# EAGLE design LedTile200mm (EAGLE 7.4.0)
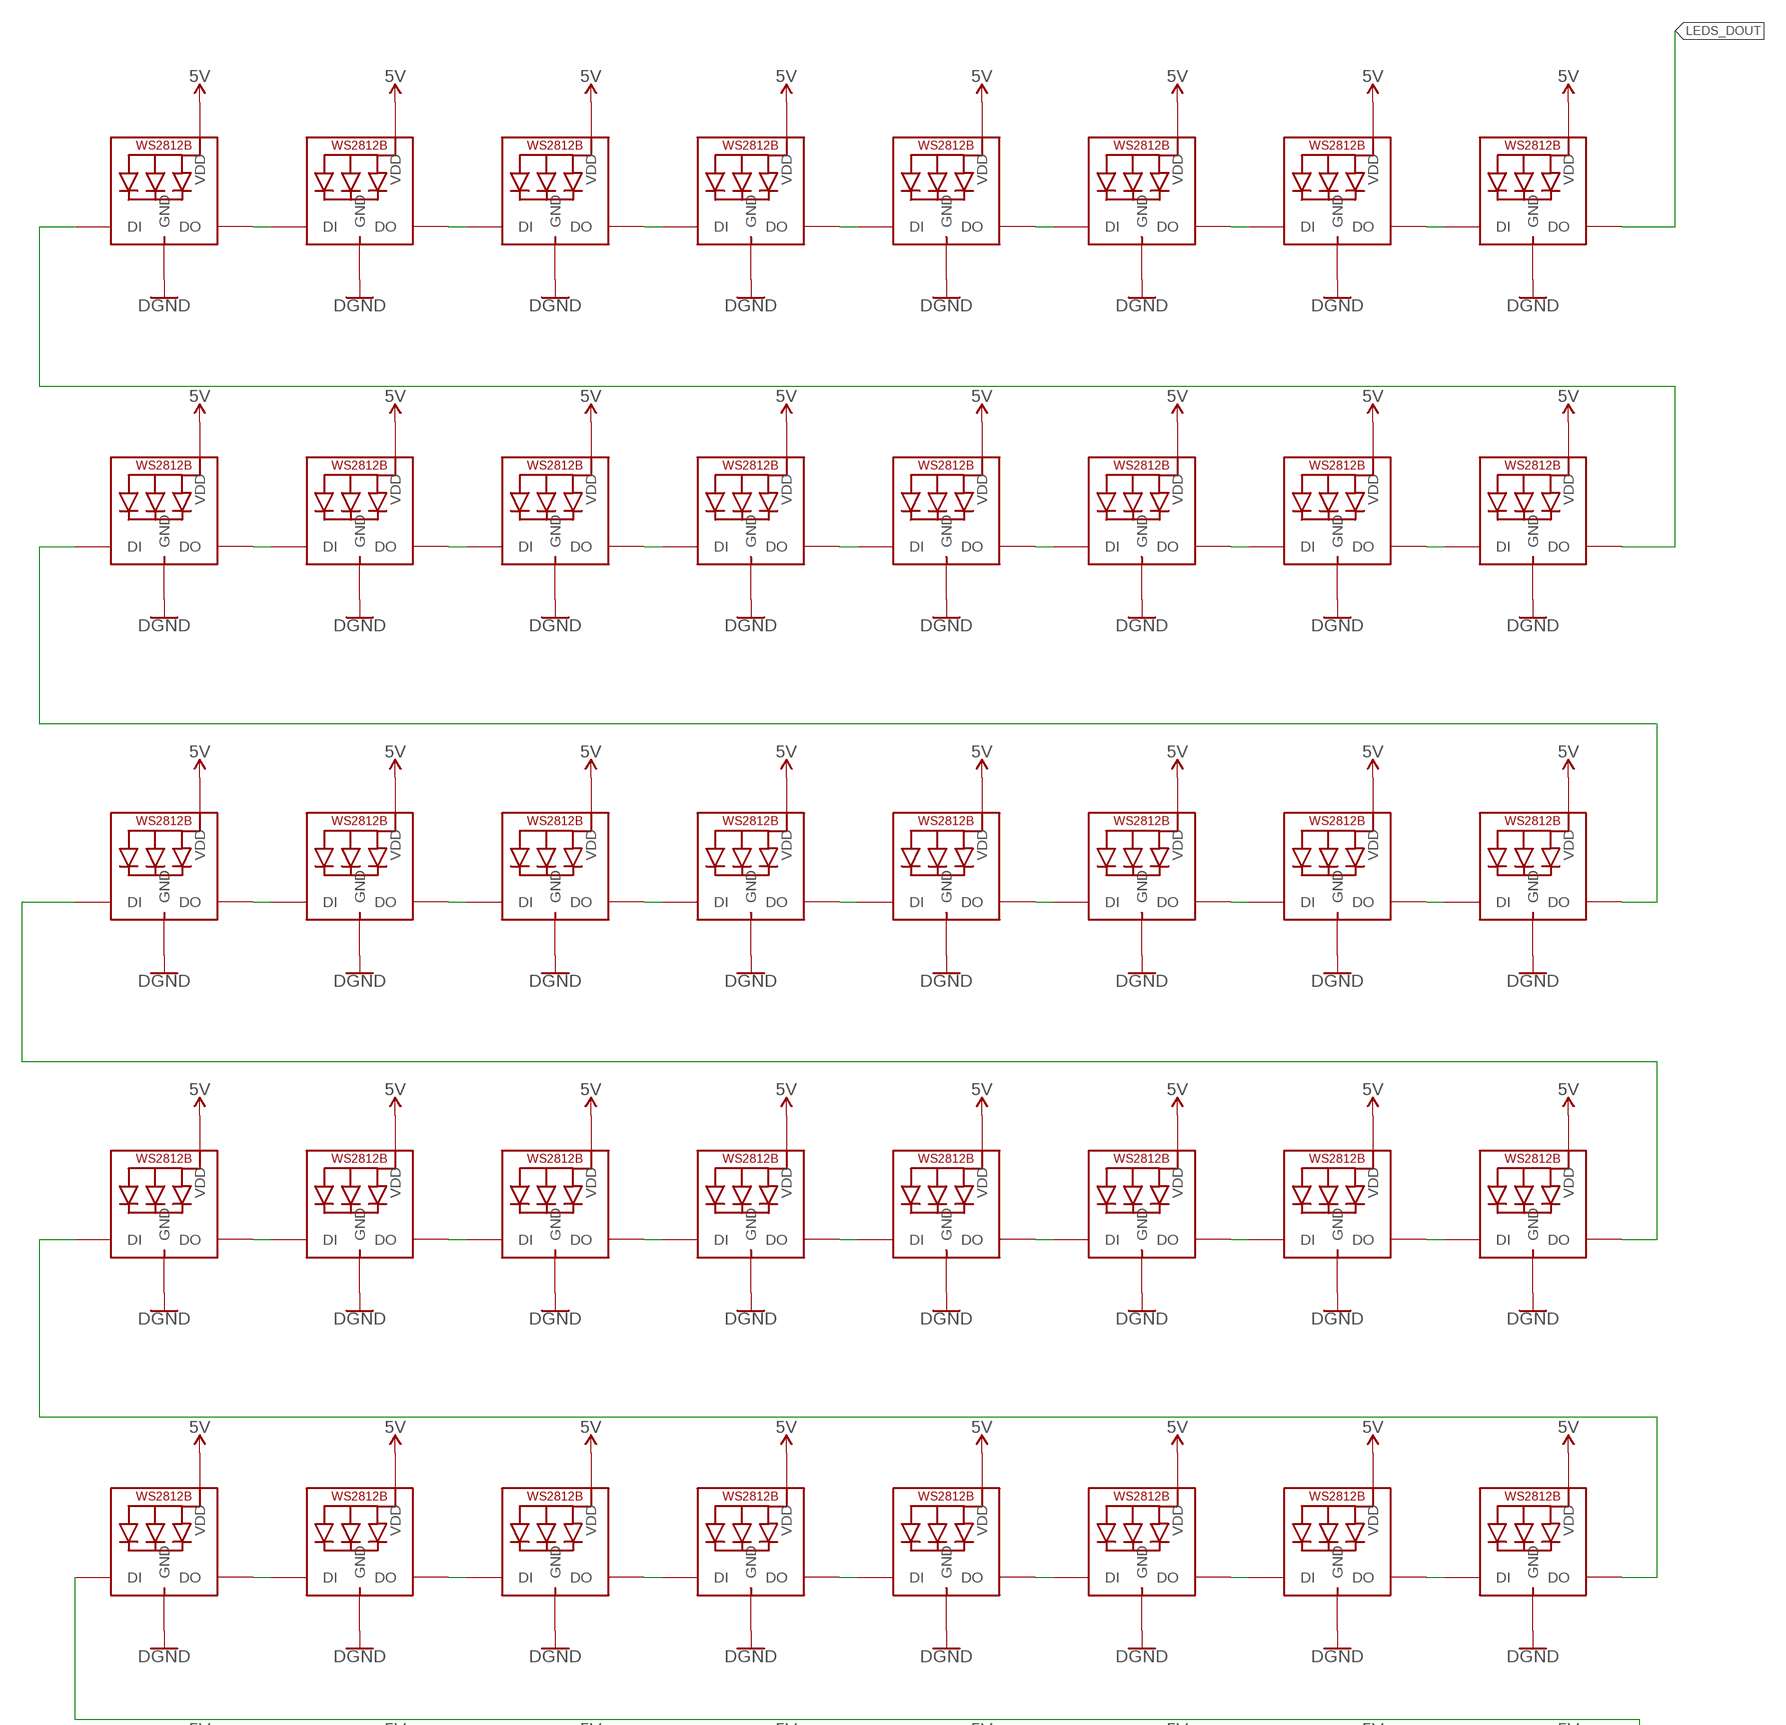
[diagram p0: schematic, sheet 1, part 1 of 3]
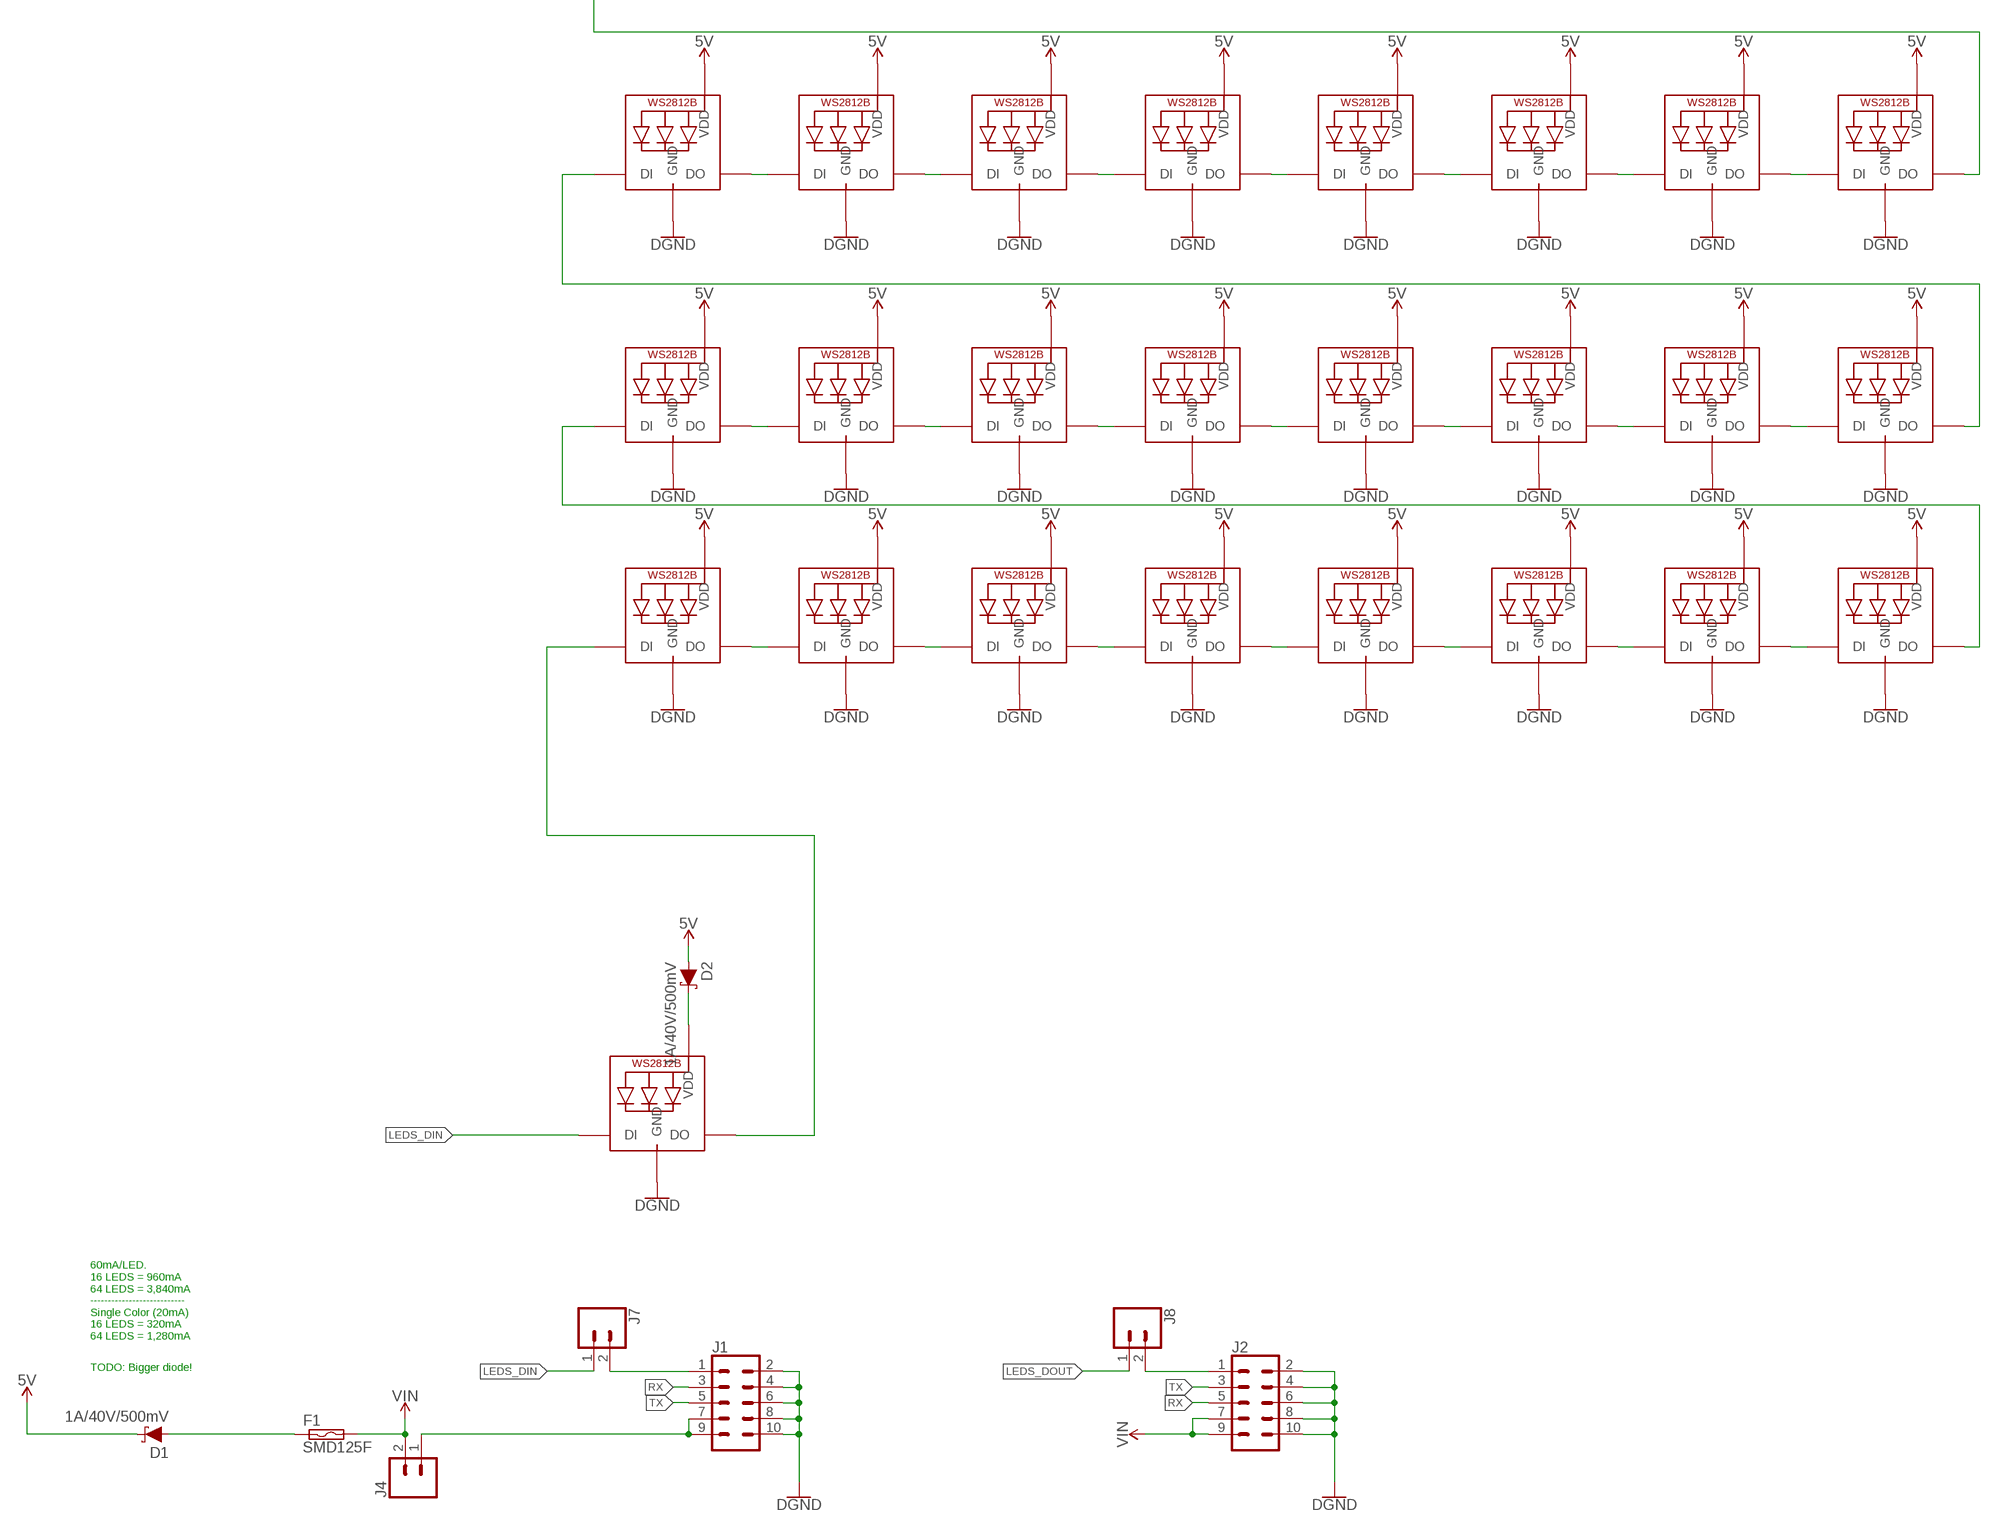
[diagram p1: schematic, sheet 1, part 2 of 3]
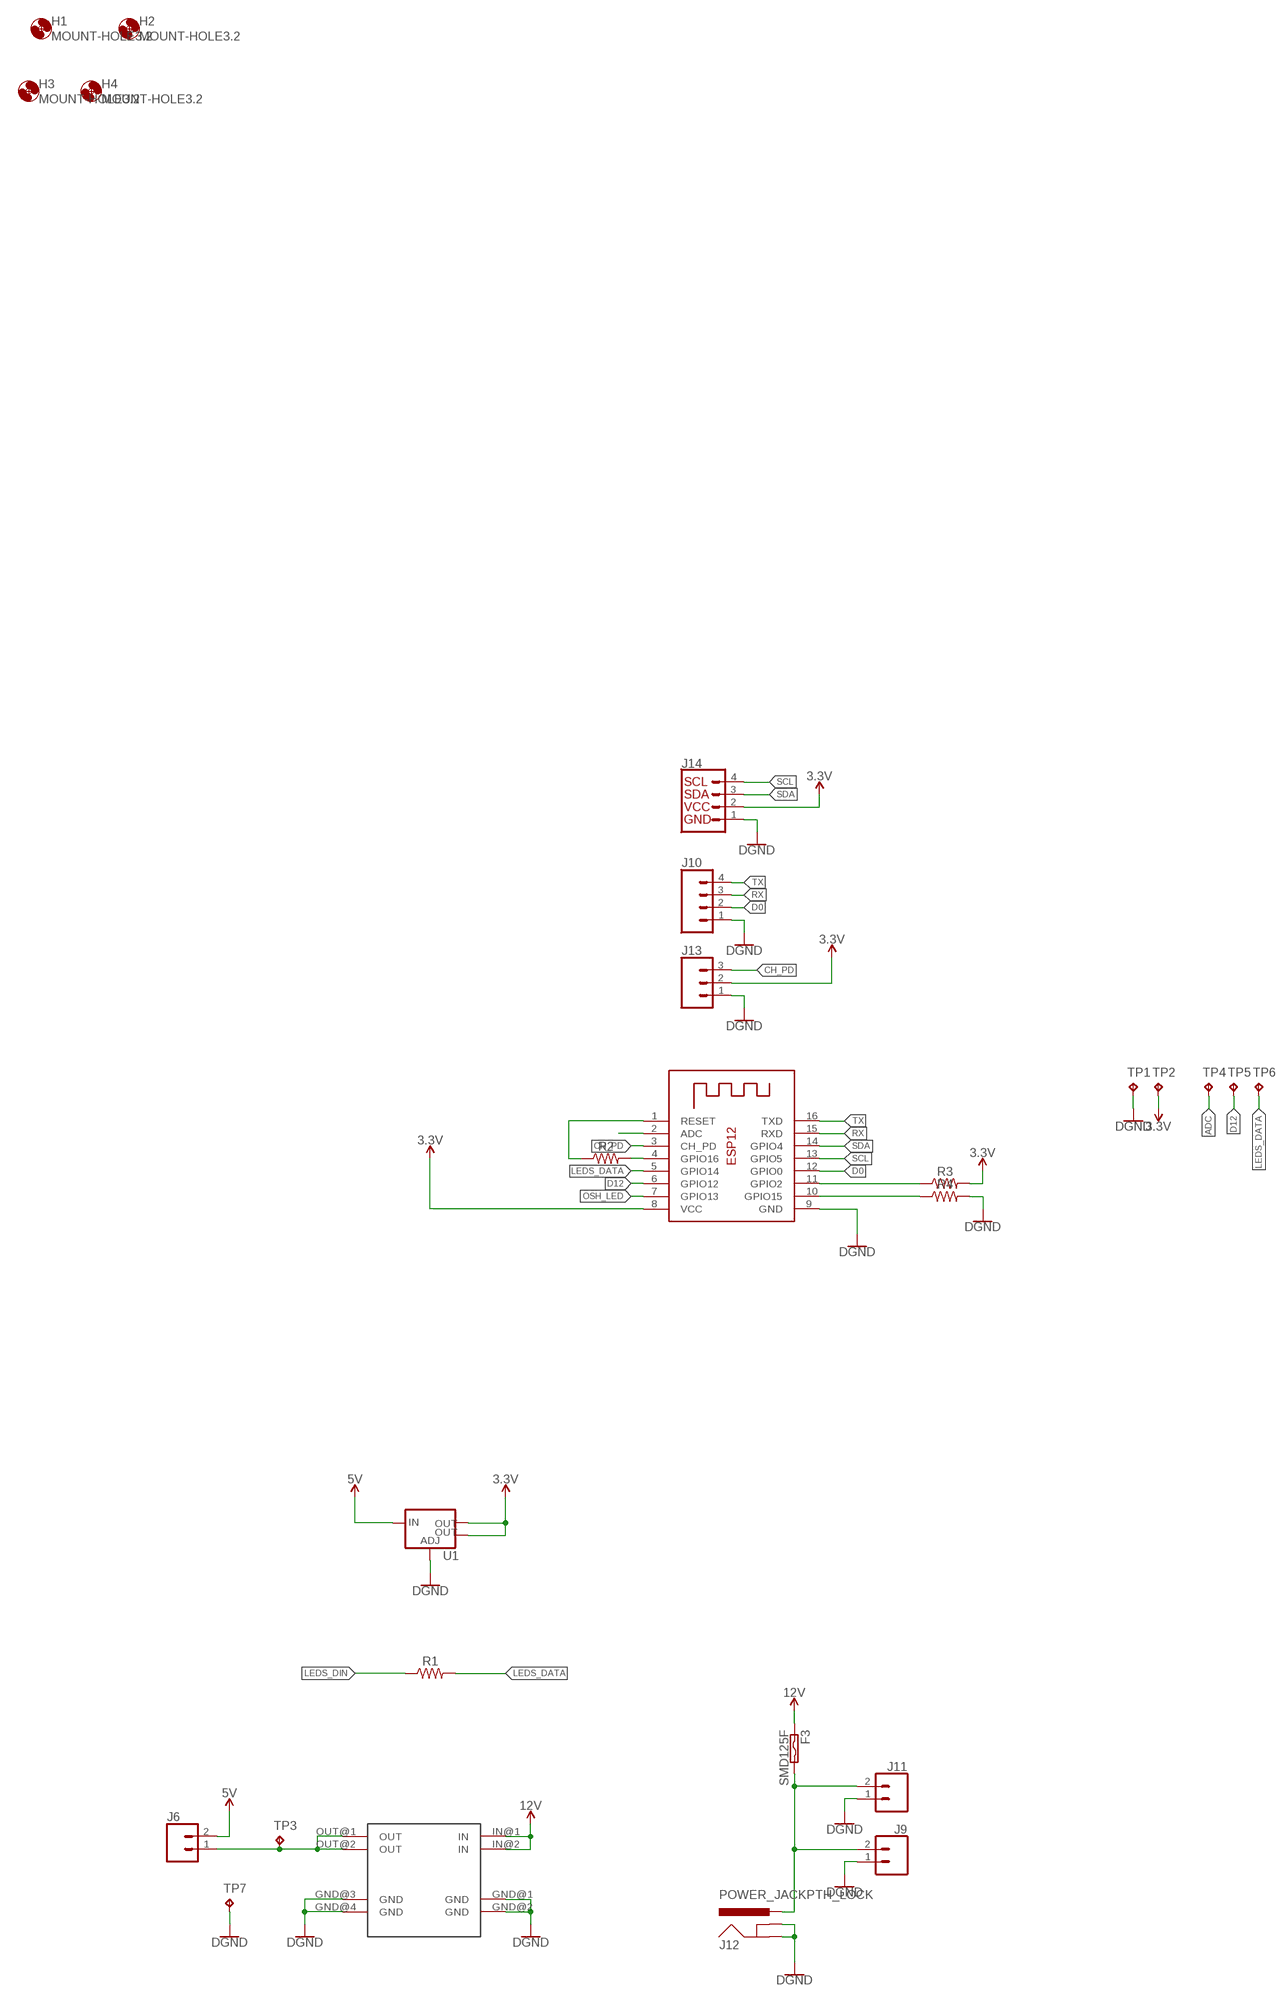
[diagram p2: schematic, sheet 1, part 3 of 3]

## Parts
D1  1A/40V/500mV  DIODE-SCHOTTKY-SS14  [SMA-DIODE]
D2  1A/40V/500mV  DIODE-SCHOTTKY-SS14  [SMA-DIODE]
F1  SMD125F  [SMD050F]
F3  SMD125F  [SMD050F]
H1  MOUNT-HOLE3.2  [3,2]
H2  MOUNT-HOLE3.2  [3,2]
H3  MOUNT-HOLE3.2  [3,2]
H4  MOUNT-HOLE3.2  [3,2]
J1  CONN_05X2RA  [2X5-RA]
J2  CONN_05X2RA  [2X5-RA]
J4  CONN_02  [1X02]
J6  CONN_02  [1X02]
J7  CONN_02  [1X02]
J8  CONN_02  [1X02]
J9  CONN_025MM  [SCREWTERMINAL-5MM-2]
J10  CONN_04  [1X04]
J11  CONN_025MM  [SCREWTERMINAL-5MM-2]
J12  POWER_JACKPTH_LOCK  [POWER_JACK_PTH_LOCK]
J13  CONN_03  [1X03]
J14  I2C_STANDARD  [1X04]
LED1  WS2812B5050  [WS2812B]
LED2  WS2812B5050  [WS2812B]
LED3  WS2812B5050  [WS2812B]
LED4  WS2812B5050  [WS2812B]
LED5  WS2812B5050  [WS2812B]
LED6  WS2812B5050  [WS2812B]
LED7  WS2812B5050  [WS2812B]
LED8  WS2812B5050  [WS2812B]
LED9  WS2812B5050  [WS2812B]
LED10  WS2812B5050  [WS2812B]
LED11  WS2812B5050  [WS2812B]
LED12  WS2812B5050  [WS2812B]
LED13  WS2812B5050  [WS2812B]
LED14  WS2812B5050  [WS2812B]
LED15  WS2812B5050  [WS2812B]
LED16  WS2812B5050  [WS2812B]
LED17  WS2812B5050  [WS2812B]
LED18  WS2812B5050  [WS2812B]
LED19  WS2812B5050  [WS2812B]
LED20  WS2812B5050  [WS2812B]
LED21  WS2812B5050  [WS2812B]
LED22  WS2812B5050  [WS2812B]
LED23  WS2812B5050  [WS2812B]
LED24  WS2812B5050  [WS2812B]
LED25  WS2812B5050  [WS2812B]
LED26  WS2812B5050  [WS2812B]
LED27  WS2812B5050  [WS2812B]
LED28  WS2812B5050  [WS2812B]
LED29  WS2812B5050  [WS2812B]
LED30  WS2812B5050  [WS2812B]
LED31  WS2812B5050  [WS2812B]
LED32  WS2812B5050  [WS2812B]
LED33  WS2812B5050  [WS2812B]
LED34  WS2812B5050  [WS2812B]
LED35  WS2812B5050  [WS2812B]
LED36  WS2812B5050  [WS2812B]
LED37  WS2812B5050  [WS2812B]
LED38  WS2812B5050  [WS2812B]
LED39  WS2812B5050  [WS2812B]
LED40  WS2812B5050  [WS2812B]
LED41  WS2812B5050  [WS2812B]
LED42  WS2812B5050  [WS2812B]
LED43  WS2812B5050  [WS2812B]
LED44  WS2812B5050  [WS2812B]
LED45  WS2812B5050  [WS2812B]
LED46  WS2812B5050  [WS2812B]
LED47  WS2812B5050  [WS2812B]
LED48  WS2812B5050  [WS2812B]
LED49  WS2812B5050  [WS2812B]
LED50  WS2812B5050  [WS2812B]
LED51  WS2812B5050  [WS2812B]
LED52  WS2812B5050  [WS2812B]
LED53  WS2812B5050  [WS2812B]
LED54  WS2812B5050  [WS2812B]
LED55  WS2812B5050  [WS2812B]
LED56  WS2812B5050  [WS2812B]
LED57  WS2812B5050  [WS2812B]
LED58  WS2812B5050  [WS2812B]
LED59  WS2812B5050  [WS2812B]
LED60  WS2812B5050  [WS2812B]
LED61  WS2812B5050  [WS2812B]
LED62  WS2812B5050  [WS2812B]
LED63  WS2812B5050  [WS2812B]
LED64  WS2812B5050  [WS2812B]
LED65  WS2812B5050  [WS2812B]
R1  RESISTOR0805  [0805]
R2  RESISTOR0805  [0805]
R3  RESISTOR0805  [0805]
R4  RESISTOR0805  [0805]
TP1  TPTP16R  [TP16R]
TP2  TPTP16R  [TP16R]
TP3  TPTP16R  [TP16R]
TP4  TPTP16R  [TP16R]
TP5  TPTP16R  [TP16R]
TP6  TPTP16R  [TP16R]
TP7  TPTP16R  [TP16R]
U1  V_REG_LM1117SOT223  [SOT223]
U$1  MINI-BUCK-MODULE-3A  [MINI-BUCK-MODULE-3A]
X1  ESP-12  [ESP-12]

## Nets
3.3V: J13.2 J14.2 R3.2 TP2.TP U1.2(OUT) U1.4(OUT) X1.8(VCC)
5V: D1.C D2.A J6.2 LED1.1-VDD(VDD) LED2.1-VDD(VDD) LED3.1-VDD(VDD) LED4.1-VDD(VDD) LED5.1-VDD(VDD) LED6.1-VDD(VDD) LED7.1-VDD(VDD) LED8.1-VDD(VDD) LED9.1-VDD(VDD) LED10.1-VDD(VDD) LED11.1-VDD(VDD) LED12.1-VDD(VDD) LED13.1-VDD(VDD) LED14.1-VDD(VDD) LED15.1-VDD(VDD) LED16.1-VDD(VDD) LED17.1-VDD(VDD) LED18.1-VDD(VDD) LED19.1-VDD(VDD) LED20.1-VDD(VDD) LED21.1-VDD(VDD) LED22.1-VDD(VDD) LED23.1-VDD(VDD) LED24.1-VDD(VDD) LED25.1-VDD(VDD) LED26.1-VDD(VDD) LED27.1-VDD(VDD) LED28.1-VDD(VDD) LED29.1-VDD(VDD) LED30.1-VDD(VDD) LED31.1-VDD(VDD) LED32.1-VDD(VDD) LED33.1-VDD(VDD) LED34.1-VDD(VDD) LED35.1-VDD(VDD) LED36.1-VDD(VDD) LED37.1-VDD(VDD) LED38.1-VDD(VDD) LED39.1-VDD(VDD) LED40.1-VDD(VDD) LED41.1-VDD(VDD) LED42.1-VDD(VDD) LED43.1-VDD(VDD) LED44.1-VDD(VDD) LED45.1-VDD(VDD) LED46.1-VDD(VDD) LED47.1-VDD(VDD) LED48.1-VDD(VDD) LED49.1-VDD(VDD) LED50.1-VDD(VDD) LED51.1-VDD(VDD) LED52.1-VDD(VDD) LED53.1-VDD(VDD) LED54.1-VDD(VDD) LED55.1-VDD(VDD) LED56.1-VDD(VDD) LED57.1-VDD(VDD) LED58.1-VDD(VDD) LED59.1-VDD(VDD) LED60.1-VDD(VDD) LED61.1-VDD(VDD) LED62.1-VDD(VDD) LED63.1-VDD(VDD) LED64.1-VDD(VDD) U1.3(IN)
12V: F3.1 U$1.IN@1(IN) U$1.IN@2(IN)
ADC: TP4.TP X1.2(ADC)
CH_PD: J13.3 X1.3(CH_PD)
D0: J10.2 X1.12(GPIO0)
D12: TP5.TP X1.6(GPIO12)
GND: J1.2 J1.4 J1.6 J1.8 J1.10 J2.2 J2.4 J2.6 J2.8 J2.10 J9.1 J10.1 J11.1 J12.GND J12.GNDBREAK J13.1 J14.1 LED1.3-GND(GND) LED2.3-GND(GND) LED3.3-GND(GND) LED4.3-GND(GND) LED5.3-GND(GND) LED6.3-GND(GND) LED7.3-GND(GND) LED8.3-GND(GND) LED9.3-GND(GND) LED10.3-GND(GND) LED11.3-GND(GND) LED12.3-GND(GND) LED13.3-GND(GND) LED14.3-GND(GND) LED15.3-GND(GND) LED16.3-GND(GND) LED17.3-GND(GND) LED18.3-GND(GND) LED19.3-GND(GND) LED20.3-GND(GND) LED21.3-GND(GND) LED22.3-GND(GND) LED23.3-GND(GND) LED24.3-GND(GND) LED25.3-GND(GND) LED26.3-GND(GND) LED27.3-GND(GND) LED28.3-GND(GND) LED29.3-GND(GND) LED30.3-GND(GND) LED31.3-GND(GND) LED32.3-GND(GND) LED33.3-GND(GND) LED34.3-GND(GND) LED35.3-GND(GND) LED36.3-GND(GND) LED37.3-GND(GND) LED38.3-GND(GND) LED39.3-GND(GND) LED40.3-GND(GND) LED41.3-GND(GND) LED42.3-GND(GND) LED43.3-GND(GND) LED44.3-GND(GND) LED45.3-GND(GND) LED46.3-GND(GND) LED47.3-GND(GND) LED48.3-GND(GND) LED49.3-GND(GND) LED50.3-GND(GND) LED51.3-GND(GND) LED52.3-GND(GND) LED53.3-GND(GND) LED54.3-GND(GND) LED55.3-GND(GND) LED56.3-GND(GND) LED57.3-GND(GND) LED58.3-GND(GND) LED59.3-GND(GND) LED60.3-GND(GND) LED61.3-GND(GND) LED62.3-GND(GND) LED63.3-GND(GND) LED64.3-GND(GND) LED65.3-GND(GND) R4.2 TP1.TP TP7.TP U1.1(ADJ) U$1.GND@1(GND) U$1.GND@2(GND) U$1.GND@3(GND) U$1.GND@4(GND) X1.9(GND) ; supply symbol labelled DGND
LEDS_DATA: R1.2 TP6.TP X1.5(GPIO14)
LEDS_DIN: J7.1 LED65.4-DIN(DI) R1.1
LEDS_DOUT: J8.1 LED64.2-DOUT(DO)
N$1: LED1.2-DOUT(DO) LED2.4-DIN(DI)
N$2: LED2.2-DOUT(DO) LED3.4-DIN(DI)
N$3: LED3.2-DOUT(DO) LED4.4-DIN(DI)
N$4: LED4.2-DOUT(DO) LED5.4-DIN(DI)
N$5: LED5.2-DOUT(DO) LED6.4-DIN(DI)
N$6: LED6.2-DOUT(DO) LED7.4-DIN(DI)
N$7: LED7.2-DOUT(DO) LED8.4-DIN(DI)
N$8: LED8.2-DOUT(DO) LED9.4-DIN(DI)
N$9: LED1.4-DIN(DI) LED65.2-DOUT(DO)
N$10: R3.1 X1.11(GPIO2)
N$11: R4.1 X1.10(GPIO15)
N$12: R2.1 X1.1(RESET)
N$13: R2.2 X1.4(GPIO16)
N$14: J6.1 TP3.TP U$1.OUT@1(OUT) U$1.OUT@2(OUT)
N$16: LED9.2-DOUT(DO) LED10.4-DIN(DI)
N$17: LED10.2-DOUT(DO) LED11.4-DIN(DI)
N$18: LED11.2-DOUT(DO) LED12.4-DIN(DI)
N$19: LED12.2-DOUT(DO) LED13.4-DIN(DI)
N$20: LED13.2-DOUT(DO) LED14.4-DIN(DI)
N$21: LED14.2-DOUT(DO) LED15.4-DIN(DI)
N$22: LED15.2-DOUT(DO) LED16.4-DIN(DI)
N$23: LED16.2-DOUT(DO) LED17.4-DIN(DI)
N$24: LED17.2-DOUT(DO) LED18.4-DIN(DI)
N$25: LED18.2-DOUT(DO) LED19.4-DIN(DI)
N$26: LED19.2-DOUT(DO) LED20.4-DIN(DI)
N$27: LED20.2-DOUT(DO) LED21.4-DIN(DI)
N$28: LED21.2-DOUT(DO) LED22.4-DIN(DI)
N$29: LED22.2-DOUT(DO) LED23.4-DIN(DI)
N$30: LED23.2-DOUT(DO) LED24.4-DIN(DI)
N$31: LED24.2-DOUT(DO) LED25.4-DIN(DI)
N$32: LED25.2-DOUT(DO) LED26.4-DIN(DI)
N$33: LED26.2-DOUT(DO) LED27.4-DIN(DI)
N$34: LED27.2-DOUT(DO) LED28.4-DIN(DI)
N$35: LED28.2-DOUT(DO) LED29.4-DIN(DI)
N$36: LED29.2-DOUT(DO) LED30.4-DIN(DI)
N$37: LED30.2-DOUT(DO) LED31.4-DIN(DI)
N$38: LED31.2-DOUT(DO) LED32.4-DIN(DI)
N$39: LED32.2-DOUT(DO) LED33.4-DIN(DI)
N$40: LED33.2-DOUT(DO) LED34.4-DIN(DI)
N$41: LED34.2-DOUT(DO) LED35.4-DIN(DI)
N$42: LED35.2-DOUT(DO) LED36.4-DIN(DI)
N$43: LED36.2-DOUT(DO) LED37.4-DIN(DI)
N$44: LED37.2-DOUT(DO) LED38.4-DIN(DI)
N$45: LED38.2-DOUT(DO) LED39.4-DIN(DI)
N$46: LED39.2-DOUT(DO) LED40.4-DIN(DI)
N$47: LED40.2-DOUT(DO) LED41.4-DIN(DI)
N$48: LED41.2-DOUT(DO) LED42.4-DIN(DI)
N$49: LED42.2-DOUT(DO) LED43.4-DIN(DI)
N$50: LED43.2-DOUT(DO) LED44.4-DIN(DI)
N$51: LED44.2-DOUT(DO) LED45.4-DIN(DI)
N$52: LED45.2-DOUT(DO) LED46.4-DIN(DI)
N$53: LED46.2-DOUT(DO) LED47.4-DIN(DI)
N$54: LED47.2-DOUT(DO) LED48.4-DIN(DI)
N$55: LED48.2-DOUT(DO) LED49.4-DIN(DI)
N$56: LED49.2-DOUT(DO) LED50.4-DIN(DI)
N$57: LED50.2-DOUT(DO) LED51.4-DIN(DI)
N$58: LED51.2-DOUT(DO) LED52.4-DIN(DI)
N$59: LED52.2-DOUT(DO) LED53.4-DIN(DI)
N$60: LED53.2-DOUT(DO) LED54.4-DIN(DI)
N$61: LED54.2-DOUT(DO) LED55.4-DIN(DI)
N$62: LED55.2-DOUT(DO) LED56.4-DIN(DI)
N$63: LED56.2-DOUT(DO) LED57.4-DIN(DI)
N$64: LED57.2-DOUT(DO) LED58.4-DIN(DI)
N$65: LED58.2-DOUT(DO) LED59.4-DIN(DI)
N$66: LED59.2-DOUT(DO) LED60.4-DIN(DI)
N$67: LED60.2-DOUT(DO) LED61.4-DIN(DI)
N$68: LED61.2-DOUT(DO) LED62.4-DIN(DI)
N$69: LED62.2-DOUT(DO) LED63.4-DIN(DI)
N$70: LED63.2-DOUT(DO) LED64.4-DIN(DI)
N$80: F3.2 J9.2 J11.2 J12.PWR
N$133: D1.A F1.1
N$134: D2.C LED65.1-VDD(VDD)
N$136: J2.1 J8.2
N$137: J1.7 J1.9 J4.1
N$141: J1.1 J7.2
OSH_LED: X1.7(GPIO13)
RX: J1.3 J2.5 J10.3 X1.15(RXD)
SCL: J14.4 X1.13(GPIO5)
SDA: J14.3 X1.14(GPIO4)
TX: J1.5 J2.3 J10.4 X1.16(TXD)
VIN: F1.2 J2.7 J2.9 J4.2

## Notes on the sheet
- 60mA/LED.
  16 LEDS = 960mA
  64 LEDS = 3,840mA
  ---------------------------
  Single Color (20mA)
  16 LEDS = 320mA
  64 LEDS = 1,280mA
- TODO: Bigger diode!

## Library data of the parts
D1 D2 = SparkFun-DiscreteSemi:DIODE-SCHOTTKY: Schottky diode A Schottky diode is a semiconductor diode which has a low forward voltage drop and a very fast switching action.; PROD_ID: DIO-08053
F1 F3 = switch-raychem:SMD*F: PolySwitch (TM) Resettable Device Source: Data sheet <http://www.farnell.com/datasheets/13482.pdf>
H1-H4 = holes:MOUNT-HOLE: MOUNTING HOLE with drill center marker
J1 J2 = SparkFun-Connectors:CONN_05X2: Multi connection point. Often used as Generic Header-pin footprint for 0.1 inch spaced/style header connections For AVR SPI programming port, see special device with nice symbol: "AVR_SPI_PROG_5x2.dev" You can populate with any combo of single row headers, but if you'd like an exact match, check these: 2x5 AVR ICSP Male Header <https://www.sparkfun.com/products/778> (PRT-00778) 2x5 Pin Shrouded Header <https://www.sparkfun.com/products/8506> (PRT-08506) On any of the 0.1 inch spaced packages, you can populate with these: Break Away Headers - Straight <https://www.sparkfun.com/products/116> (PRT-00116) Break Away Male Headers - Right Angle <https://www.sparkfun.com/products/553> (PRT-00553) Female Headers <https://www.sparkfun.com/products/115> (PRT-00115) Break Away Headers - Machine Pin <https://www.sparkfun.com/products/117> (PRT-00117) Break Away Female Headers - Swiss Machine Pin <https://www.sparkfun.com/products/743> (PRT-00743) Special note: the shrouded connector mates well with our 5x2 ribbon cables: 2x5 Pin IDC Ribbon Cable <https://www.sparkfun.com/products/8535> (PRT-08535)
J4 J6-J8 = SparkFun-Connectors:CONN_02: Multi connection point. Often used as Generic Header-pin footprint for 0.1 inch spaced/style header connections On any of the 0.1 inch spaced packages, you can populate with these: Break Away Headers - Straight <https://www.sparkfun.com/products/116> (PRT-00116) Break Away Male Headers - Right Angle <https://www.sparkfun.com/products/553> (PRT-00553) Female Headers <https://www.sparkfun.com/products/115> (PRT-00115) Break Away Headers - Machine Pin <https://www.sparkfun.com/products/117> (PRT-00117) Break Away Female Headers - Swiss Machine Pin <https://www.sparkfun.com/products/743> (PRT-00743) For SCREWTERMINALS and SPRING TERMINALS visit here: Screw Terimnals on SparkFun.com <https://www.sparkfun.com/search/results?term=Screw+Terminals> (5mm/3.5mm/2.54mm spacing) This device is also useful as a general connection point to wire up your design to another part of your project. Our various solder wires solder well into these plated through hole pads. Hook-Up Wire - Assortment (Stranded, 22 AWG) <https://www.sparkfun.com/products/11375> (PRT-11375) Hook-Up Wire - Assortment (Solid Core, 22 AWG) <https://www.sparkfun.com/products/11367> (PRT-11367) View the entire wire category on our website here <https://www.sparkfun.com/categories/141> Special notes: Molex polarized connector foot print use with: PRT-08233 with associated crimp pins and housings. 2.54_SCREWTERM for use with PRT-10571. 3.5mm Screw Terminal footprints for PRT-08084 5mm Screw Terminal footprints for use with PRT-08432
J9 J11 = SparkFun-Connectors:CONN_02: Multi connection point. Often used as Generic Header-pin footprint for 0.1 inch spaced/style header connections On any of the 0.1 inch spaced packages, you can populate with these: Break Away Headers - Straight <https://www.sparkfun.com/products/116> (PRT-00116) Break Away Male Headers - Right Angle <https://www.sparkfun.com/products/553> (PRT-00553) Female Headers <https://www.sparkfun.com/products/115> (PRT-00115) Break Away Headers - Machine Pin <https://www.sparkfun.com/products/117> (PRT-00117) Break Away Female Headers - Swiss Machine Pin <https://www.sparkfun.com/products/743> (PRT-00743) For SCREWTERMINALS and SPRING TERMINALS visit here: Screw Terimnals on SparkFun.com <https://www.sparkfun.com/search/results?term=Screw+Terminals> (5mm/3.5mm/2.54mm spacing) This device is also useful as a general connection point to wire up your design to another part of your project. Our various solder wires solder well into these plated through hole pads. Hook-Up Wire - Assortment (Stranded, 22 AWG) <https://www.sparkfun.com/products/11375> (PRT-11375) Hook-Up Wire - Assortment (Solid Core, 22 AWG) <https://www.sparkfun.com/products/11367> (PRT-11367) View the entire wire category on our website here <https://www.sparkfun.com/categories/141> Special notes: Molex polarized connector foot print use with: PRT-08233 with associated crimp pins and housings. 2.54_SCREWTERM for use with PRT-10571. 3.5mm Screw Terminal footprints for PRT-08084 5mm Screw Terminal footprints for use with PRT-08432; SF_SKU: PRT-08432
J10 = SparkFun-Connectors:CONN_04: Multi connection point. Often used as Generic Header-pin footprint for 0.1 inch spaced/style header connections On any of the 0.1 inch spaced packages, you can populate with these: Break Away Headers - Straight <https://www.sparkfun.com/products/116> (PRT-00116) Break Away Male Headers - Right Angle <https://www.sparkfun.com/products/553> (PRT-00553) Female Headers <https://www.sparkfun.com/products/115> (PRT-00115) Break Away Headers - Machine Pin <https://www.sparkfun.com/products/117> (PRT-00117) Break Away Female Headers - Swiss Machine Pin <https://www.sparkfun.com/products/743> (PRT-00743) For SCREWTERMINALS and SPRING TERMINALS visit here: Screw Terimnals on SparkFun.com <https://www.sparkfun.com/search/results?term=Screw+Terminals> (5mm/3.5mm/2.54mm spacing) This device is also useful as a general connection point to wire up your design to another part of your project. Our various solder wires solder well into these plated through hole pads. Hook-Up Wire - Assortment (Stranded, 22 AWG) <https://www.sparkfun.com/products/11375> (PRT-11375) Hook-Up Wire - Assortment (Solid Core, 22 AWG) <https://www.sparkfun.com/products/11367> (PRT-11367) View the entire wire category on our website here <https://www.sparkfun.com/categories/141> Special notes: Molex polarized connector foot print use with SKU : PRT-08231 with associated crimp pins and housings. 1MM SMD Version SKU: PRT-10208; PROD_ID: CONN-09696
J12 = SparkFun-Connectors:POWER_JACK: Power Jack Connector This is the standard 5.5mm barrel jack for power. The PTH is the most common, proven, reliable, footprint. The Slot footprint only works if the mill layer is transmitted to the PCB fab house so be warned. Here are the connectors we sell at SparkFun: DC Barrel Power Jack/Connector <https://www.sparkfun.com/products/119> (PRT-00119) DC Barrel Power Jack/Connector (SMD) <https://www.sparkfun.com/products/12748> (PRT-12748) DC Barrel Jack Adapter - Breadboard Compatible <https://www.sparkfun.com/products/10811> (PRT-10811) It is used on this SparkFun product (and many, many others): SparkFun RedBoard - Programmed with Arduino <https://www.sparkfun.com/products/12757> (DEV-12757) Also, if you need a mating power supply or connector, please check these out: Wall Adapter Power Supply - 9VDC 650mA <https://www.sparkfun.com/products/298> (TOL-00298) DC Barrel Jack Adapter - Male <https://www.sparkfun.com/products/10287> (PRT-10287); PROD_ID: CONN-08197; SF_ID: PRT-00119
J13 = SparkFun-Connectors:CONN_03: Multi connection point. Often used as Generic Header-pin footprint for 0.1 inch spaced/style header connections On any of the 0.1 inch spaced packages, you can populate with these: Break Away Headers - Straight <https://www.sparkfun.com/products/116> (PRT-00116) Break Away Male Headers - Right Angle <https://www.sparkfun.com/products/553> (PRT-00553) Female Headers <https://www.sparkfun.com/products/115> (PRT-00115) Break Away Headers - Machine Pin <https://www.sparkfun.com/products/117> (PRT-00117) Break Away Female Headers - Swiss Machine Pin <https://www.sparkfun.com/products/743> (PRT-00743) Stackable Header - 3 Pin (Female, 0.1") <https://www.sparkfun.com/products/13875> (PRT-13875) For SCREWTERMINALS and SPRING TERMINALS visit here: Screw Terimnals on SparkFun.com <https://www.sparkfun.com/search/results?term=Screw+Terminals> (5mm/3.5mm/2.54mm spacing) This device is also useful as a general connection point to wire up your design to another part of your project. Our various solder wires solder well into these plated through hole pads. Hook-Up Wire - Assortment (Stranded, 22 AWG) <https://www.sparkfun.com/products/11375> (PRT-11375) Hook-Up Wire - Assortment (Solid Core, 22 AWG) <https://www.sparkfun.com/products/11367> (PRT-11367) View the entire wire category on our website here <https://www.sparkfun.com/categories/141> Special notes: Molex polarized connector foot print use with SKU : PRT-08232 with associated crimp pins and housings.
J14 = SparkFun-Connectors:I2C_STANDARD: SparkFun I2C Standard Pinout Header SparkFun has standardized on a pinout for all I2C based sensor breakouts. This pinout allows I2C boards to be plugged directly into the headers on Arduino Uno compatible boards, and to be daisy chained easily. Example SparkFun Products: SparkFun Atmospheric Sensor Breakout - BME280 <https://www.sparkfun.com/products/13676> SparkFun Altitude/Pressure Sensor Breakout - MPL3115A2 <https://www.sparkfun.com/products/11084> SparkFun TOF Range Finder Sensor - VL6180 <https://www.sparkfun.com/products/12785>
LED1-LED65 = adafruit:WS2812B
R1-R4 = SparkFun-Resistors:RESISTOR: Generic Resistor Package
TP1-TP7 = testpad:TP: Test pad
U1 = SparkFun-IC-Power:V_REG_LM1117: Voltage Regulator LM1117 Standard adjustable voltage regulator but in SMD form. Spark Fun Electronics SKU : COM-00595; PROD_ID: VREG-08170
U$1 = Tinamous:MINI-BUCK-MODULE-3A
X1 = adafruit:ESP-12

## Board
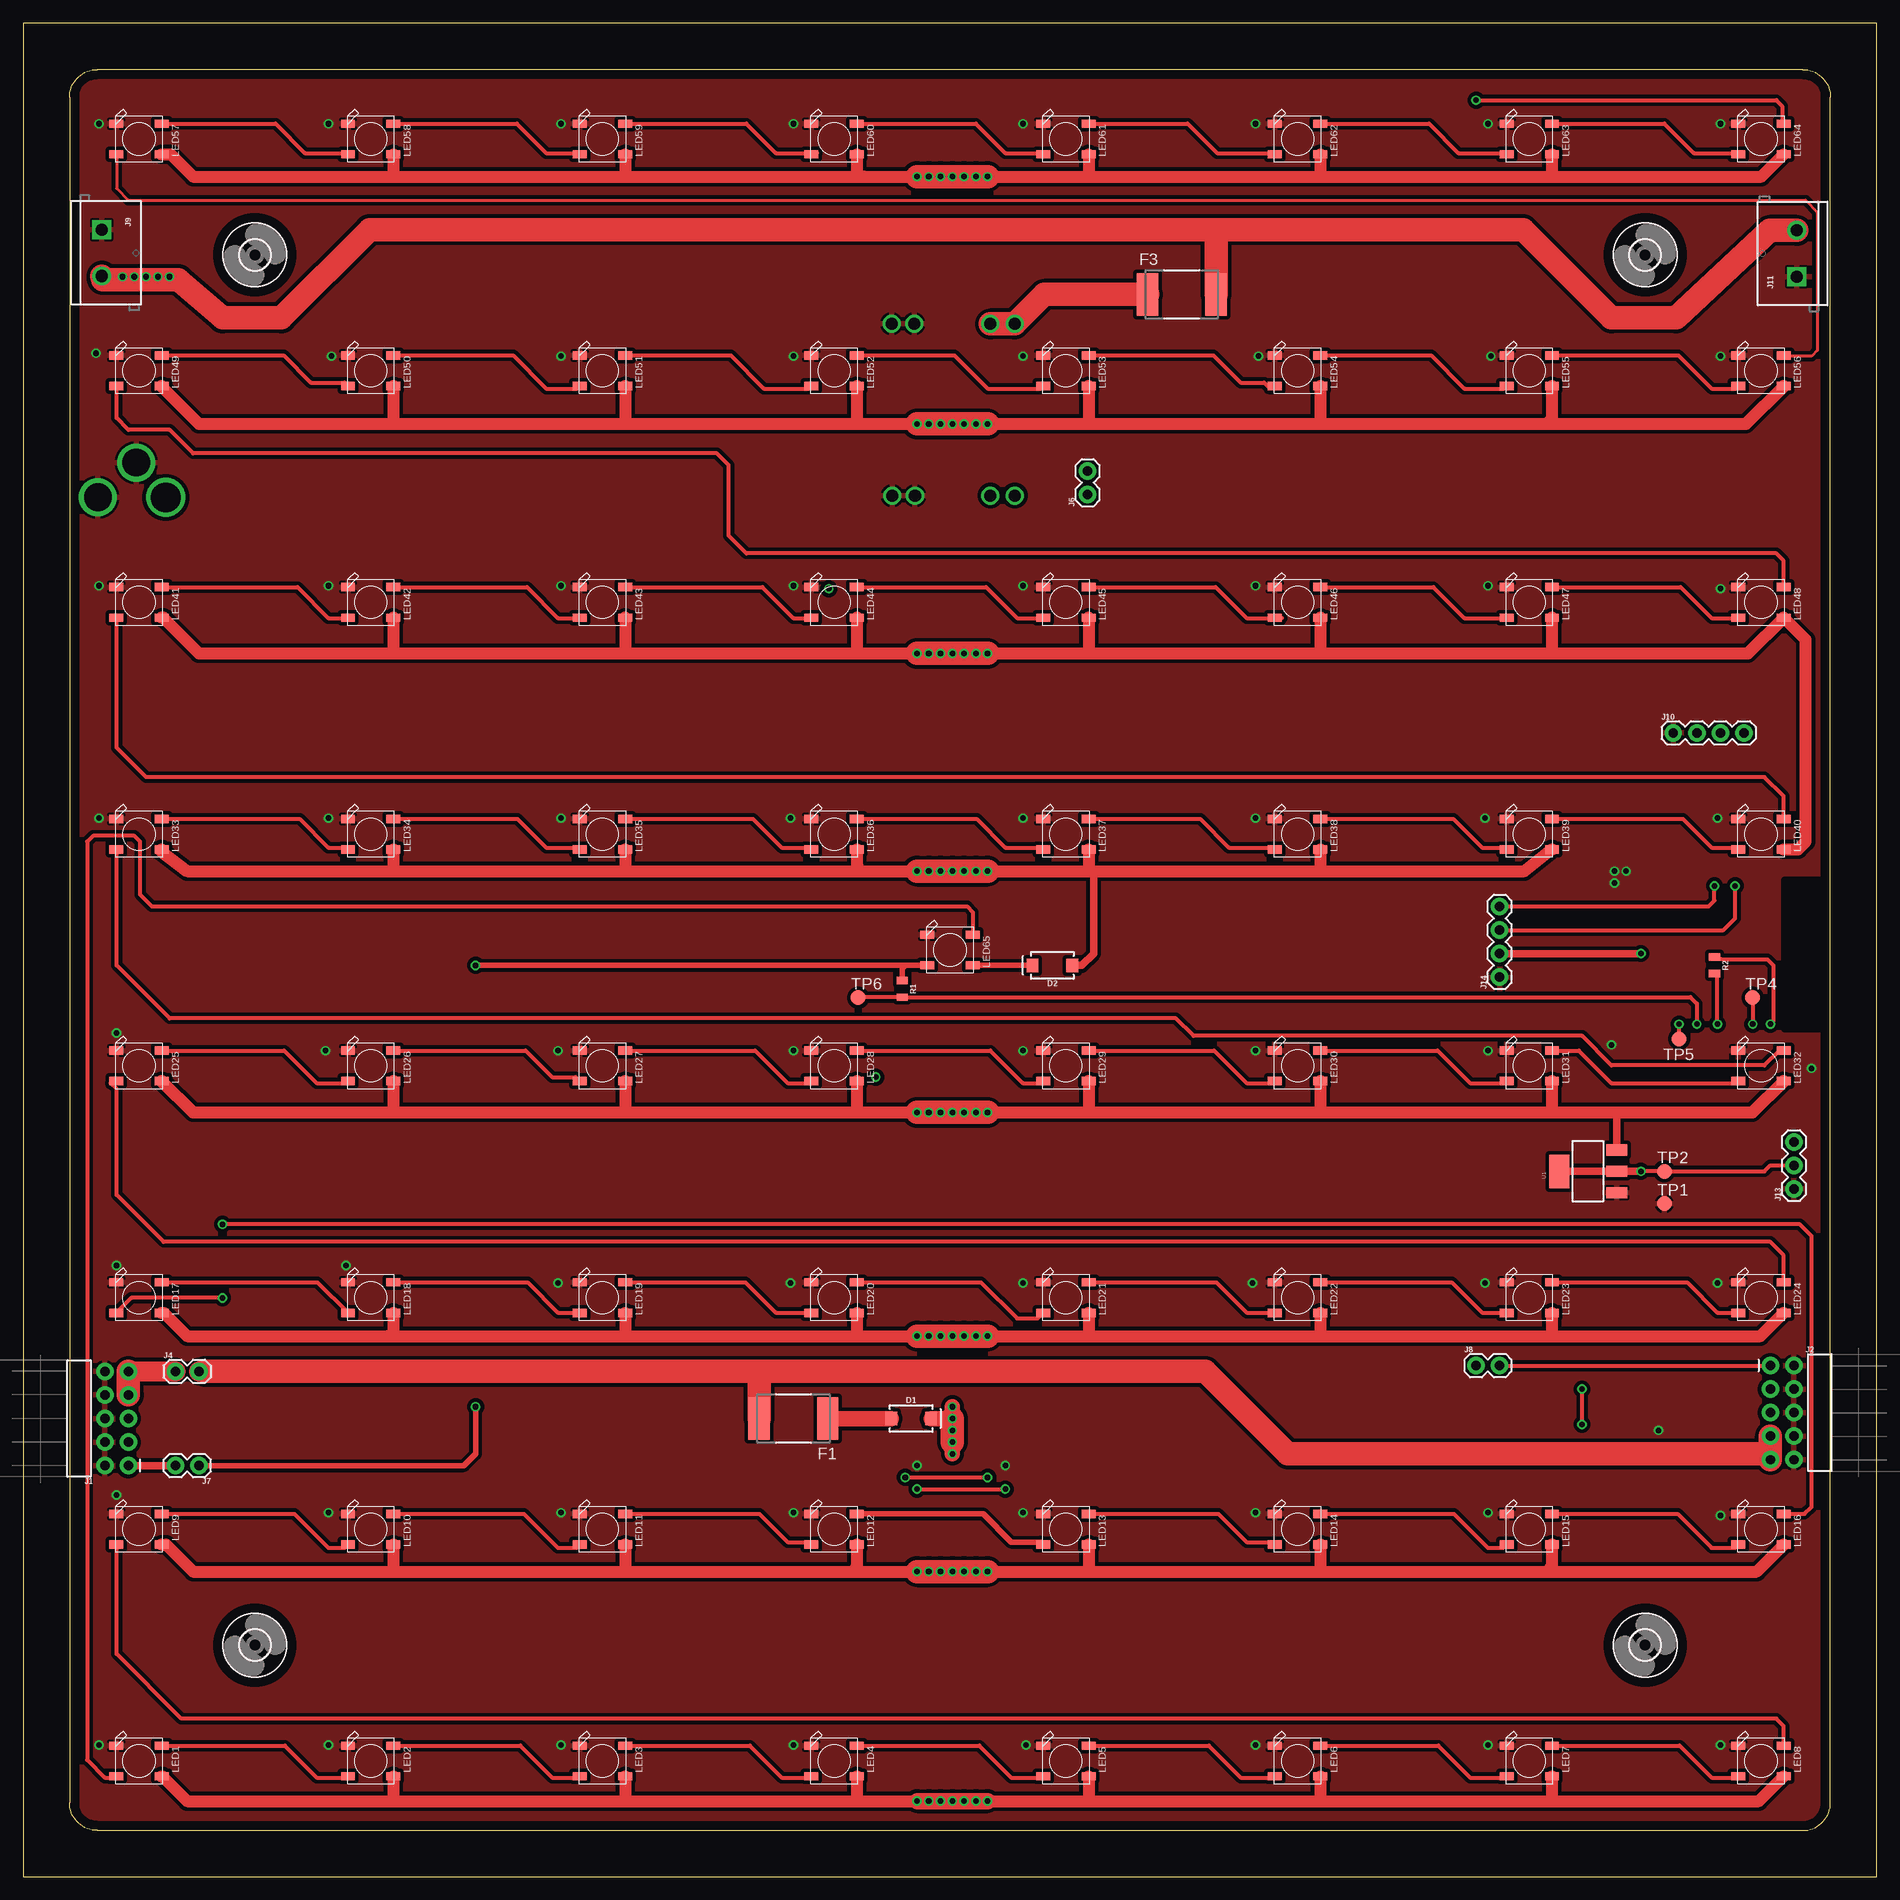
[diagram p3: board, top side]
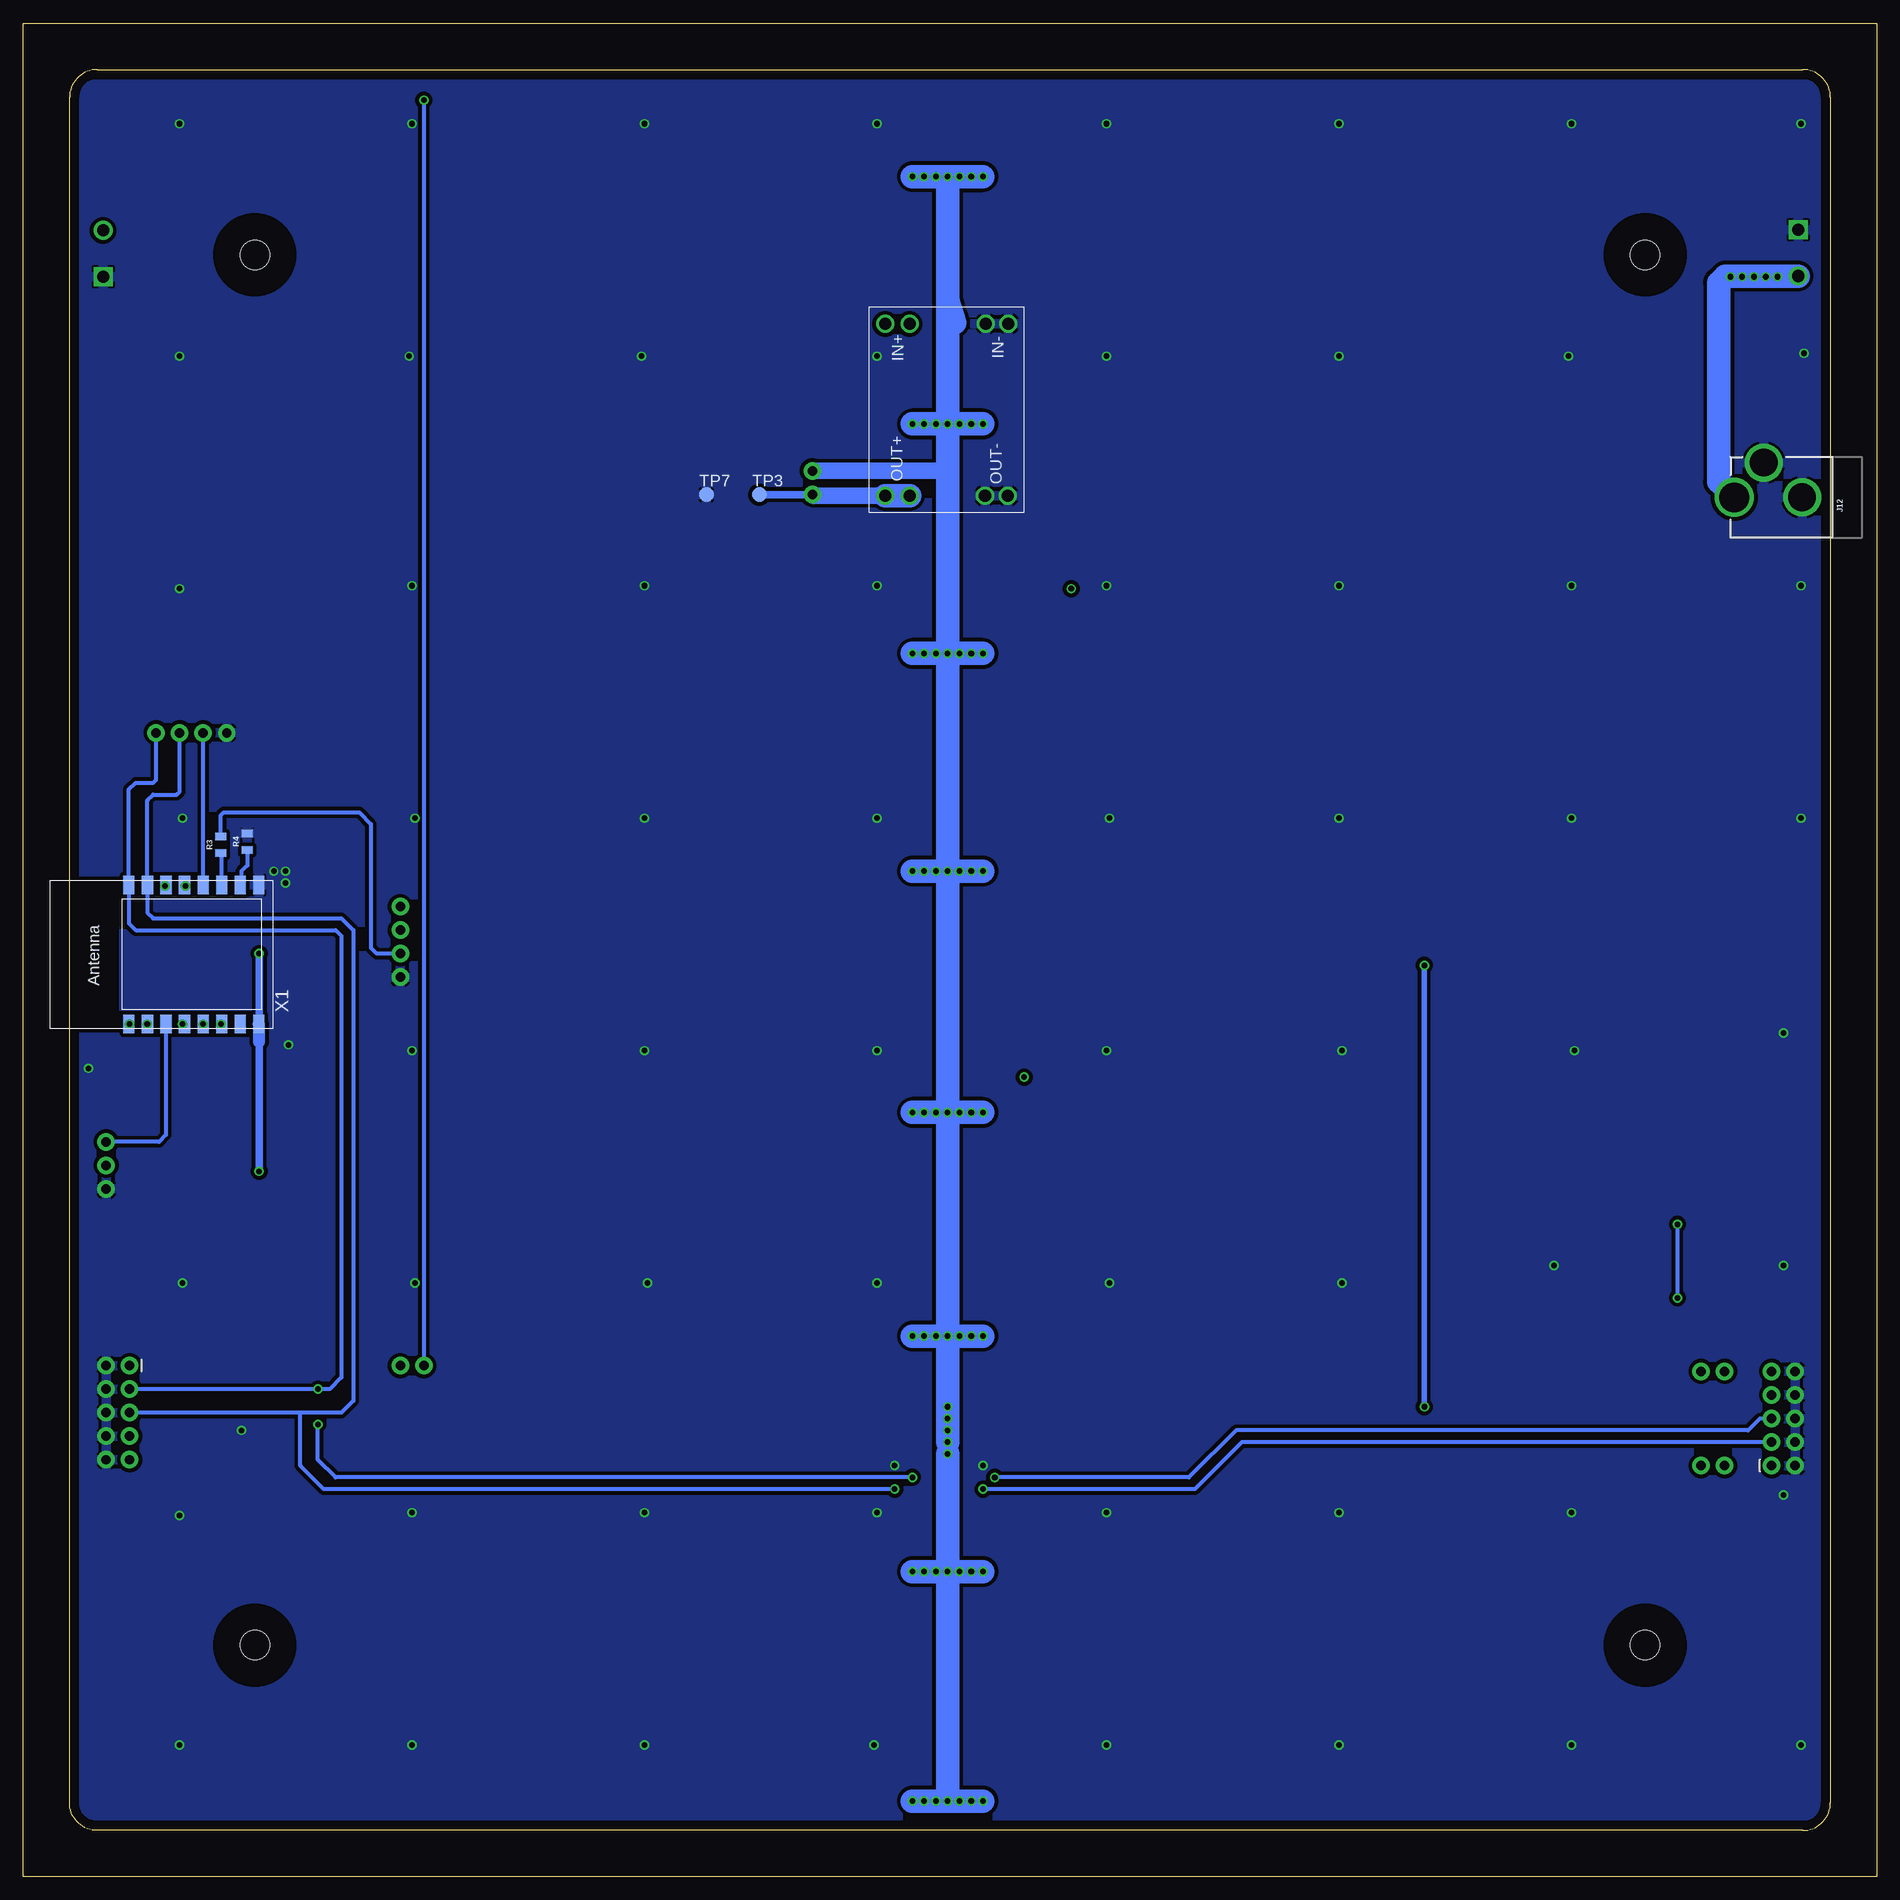
[diagram p4: board, bottom side, seen from below]

Size 200 x 200 mm. Coordinates in mm from the lower left corner, seen from the top.
Outline: 8,5 192,5 arc90 195,8 195,192 arc90 192,195 8,195 arc90 5,192 5,8 arc90 8,5
Outline: 0,0 200,0 200,200 0,200 0,0
Copper layers (1*16): Top 0.035mm / dielectric 1.5mm / Bottom 0.035mm
Design rules "default": minimum track width 10mil, minimum drill 0.6mm, track to track 8mil, track to pad 8mil, pad to pad 8mil, via to via 8mil, smd to smd 8mil, copper to edge 40mil, drill to drill 8mil, minimum pad ring 10mil, minimum via ring 8mil, stop-mask expansion 4mil, vias tented up to drill 0mil, thermal gap 10mil

### Footprints (pad centres in the part's own frame; a part is rotated, then mirrored left to right if it is on the bottom)
SMA-DIODE = smd 1.27 x 1.47: A -2.15,0; C 2.15,0
SMD050F = smd 2.3 x 4.6: 1 -3.7,0; 2 3.7,0
3,2 = hole 3.2: 0,0
2X5-RA = drill 1.016 pad 1.88: 1 -1.27,5.08; 2 1.27,5.08; 3 -1.27,2.54; 4 1.27,2.54; 5 -1.27,0; 6 1.27,0; 7 -1.27,-2.54; 8 1.27,-2.54; 9 -1.27,-5.08; 10 1.27,-5.08
1X02 = drill 1.016 pad 1.88: 1 0,0; 2 2.54,0
SCREWTERMINAL-5MM-2 = drill 1.3 pad 2.032 square: 1 0,0 | drill 1.3 pad 2.032: 2 5,0
1X04 = drill 1.016 pad 1.88: 1 0,0; 2 2.54,0; 3 5.08,0; 4 7.62,0
POWER_JACK_PTH_LOCK = drill 2.997 pad 4.115: GND 0.025,6.557; GNDBREAK 3.762,10.7 | drill 3.2 pad 4.115: PWR 0,13.878
1X03 = drill 1.016 pad 1.88: 1 0,0; 2 2.54,0; 3 5.08,0
WS2812B = smd 1.5 x 0.9: 1-VDD 2.45,-1.65; 2-DOUT 2.45,1.65; 3-GND -2.45,1.65; 4-DIN -2.45,-1.65
0805 = smd 0.8 x 1.2: 1 -0.9,0; 2 0.9,0
TP16R = smd 1.6 x 1.6: TP 0,0
SOT223 = smd 1.219 x 2.235: 1 -2.311,-3.099; 2 0,-3.099; 3 2.311,-3.099 | smd 3.6 x 2.2: 4 0,3.099
MINI-BUCK-MODULE-3A = drill 1.3: GND@1 20.32,4.13; GND@2 20.32,1.7; GND@3 1.778,4.228; GND@4 1.778,1.778; IN@1 20.32,14.986; IN@2 20.32,12.356; OUT@1 1.778,14.986; OUT@2 1.778,12.356
ESP-12 = smd 2 x 1.2: 1 -7.5,4.5; 2 -7.5,2.5; 3 -7.5,0.5; 4 -7.5,-1.5; 5 -7.5,-3.5; 6 -7.5,-5.5; 7 -7.5,-7.5; 8 -7.5,-9.5; 9 7.5,-9.5; 10 7.5,-7.5; 11 7.5,-5.5; 12 7.5,-3.5; 13 7.5,-1.5; 14 7.5,0.5; 15 7.5,2.5; 16 7.5,4.5

### Placement (x,y rotation side)
D1  95.81,49.45 0 top
D2  111.05,98.34 180 top
F1  83.11,49.45 180 top
F3  125.02,170.74 0 top
H1  25,25 0 top
H2  175,25 0 top
H3  25,175 0 top
H4  175,175 0 top
J1  10.08,49.45 180 top
J2  189.78,50.09 0 top
J4  16.43,54.53 0 top
J6  114.86,149.15 90 top
J7  18.97,44.37 180 top
J8  156.76,55.16 0 top
J9  8.49,177.72 270 top
J10  178.04,123.43 0 top
J11  191.37,172.64 90 top
J12  1.51,148.83 90 bottom
J13  191.06,74.22 90 top
J14  159.31,97.08 90 top
LED1  12.5,12.5 0 top
LED2  37.5,12.5 0 top
LED3  62.5,12.5 0 top
LED4  87.5,12.5 0 top
LED5  112.5,12.5 0 top
LED6  137.5,12.5 0 top
LED7  162.5,12.5 0 top
LED8  187.5,12.5 0 top
LED9  12.5,37.5 0 top
LED10  37.5,37.5 0 top
LED11  62.5,37.5 0 top
LED12  87.5,37.5 0 top
LED13  112.5,37.5 0 top
LED14  137.5,37.5 0 top
LED15  162.5,37.5 0 top
LED16  187.5,37.5 0 top
LED17  12.5,62.5 0 top
LED18  37.5,62.5 0 top
LED19  62.5,62.5 0 top
LED20  87.5,62.5 0 top
LED21  112.5,62.5 0 top
LED22  137.5,62.5 0 top
LED23  162.5,62.5 0 top
LED24  187.5,62.5 0 top
LED25  12.5,87.5 0 top
LED26  37.5,87.5 0 top
LED27  62.5,87.5 0 top
LED28  87.5,87.5 0 top
LED29  112.5,87.5 0 top
LED30  137.5,87.5 0 top
LED31  162.5,87.5 0 top
LED32  187.5,87.5 0 top
LED33  12.5,112.5 0 top
LED34  37.5,112.5 0 top
LED35  62.5,112.5 0 top
LED36  87.5,112.5 0 top
LED37  112.5,112.5 0 top
LED38  137.5,112.5 0 top
LED39  162.5,112.5 0 top
LED40  187.5,112.5 0 top
LED41  12.5,137.5 0 top
LED42  37.5,137.5 0 top
LED43  62.5,137.5 0 top
LED44  87.5,137.5 0 top
LED45  112.5,137.5 0 top
LED46  137.5,137.5 0 top
LED47  162.5,137.5 0 top
LED48  187.5,137.5 0 top
LED49  12.5,162.5 0 top
LED50  37.5,162.5 0 top
LED51  62.5,162.5 0 top
LED52  87.5,162.5 0 top
LED53  112.5,162.5 0 top
LED54  137.5,162.5 0 top
LED55  162.5,162.5 0 top
LED56  187.5,162.5 0 top
LED57  12.5,187.5 0 top
LED58  37.5,187.5 0 top
LED59  62.5,187.5 0 top
LED60  87.5,187.5 0 top
LED61  112.5,187.5 0 top
LED62  137.5,187.5 0 top
LED63  162.5,187.5 0 top
LED64  187.5,187.5 0 top
LED65  100,100 0 top
R1  94.85,95.81 270 top
R2  182.48,98.34 270 top
R3  178.67,111.36 90 bottom
R4  175.81,111.68 90 bottom
TP1  177.09,72.63 0 top
TP2  177.09,76.12 0 top
TP3  120.57,149.15 0 bottom
TP4  186.61,94.85 0 top
TP5  178.67,90.41 0 top
TP6  90.09,94.85 0 top
TP7  126.28,149.15 0 bottom
U1  168.83,76.12 90 top
U$1  92,147.24 90 bottom
X1  184.09,99.53 90 bottom

### Tracks (layer width: path | path; a pad name or v marks a point on that pad's centre or on a via)
3.3V  (via drill 0.6)
  Top 0.406: v174.54,76.12 TP2.TP 187.88,76.12 188.51,76.75 J13.2
  Top 0.813: U1.4 U1.2 v174.54,76.12 | J14.2 v174.54,99.61
  Bottom 0.406: 174.54,92.08 X1.8 | J14.2 161.84,99.61 162.48,100.25 162.48,113.58 163.75,114.86 178.35,114.86 178.67,114.54 R3.2
  Bottom 0.813: v174.54,76.12 174.54,92 | v174.54,99.61 174.54,92.08
  Bottom 1.27: 174.54,90.09 174.54,91.98 | 174.54,92 174.54,91.98 | 174.54,91.98 X1.8
5V  (via drill 0.6)
  Top 0.813: D2.A 114.22,98.34 115.49,99.61 115.49,108.5 | U1.3 171.92,82.56 172,82.47
  Top 1.27: LED1.1-VDD 15.03,10.85 17.7,8.18 39.92,8.18 | 39.92,8.18 64.69,8.18 | 64.69,8.18 90.09,8.18 | 90.09,8.18 v96.44,8.18 | v104.06,8.18 114.86,8.18 | 114.86,8.18 140.25,8.18 | 140.25,8.18 165.02,8.18 | 165.02,8.18 187.28,8.18 LED8.1-VDD | LED9.1-VDD 15.43,35.85 18.34,32.94 39.92,32.94 | 39.92,32.94 64.69,32.94 | 64.69,32.94 89.45,32.94 | 89.45,32.94 v96.44,32.94 | v104.06,32.94 114.86,32.94 | 114.86,32.94 139.62,32.94 | 139.62,32.94 164.38,32.94 | 164.38,32.94 187.04,32.94 LED16.1-VDD | LED17.1-VDD 15.19,60.85 17.7,58.34 39.29,58.34 | 39.29,58.34 64.69,58.34 | 64.69,58.34 90.09,58.34 | 90.09,58.34 v96.44,58.34 | LED25.1-VDD 18.34,82.47 39.92,82.47 | 39.92,82.47 64.69,82.47 | 64.69,82.47 90.09,82.47 | 90.09,82.47 v96.44,82.47 | v104.06,82.47 114.86,82.47 | 114.86,82.47 140.25,82.47 | 140.25,82.47 165.02,82.47 | 165.02,82.47 172,82.47 186.57,82.47 LED32.1-VDD | LED41.1-VDD 15.12,135.85 18.97,132 39.92,132 | 39.92,132 64.69,132 | 64.69,132 90.09,132 | 90.09,132 v96.44,132 | v104.06,132 114.86,132 | 114.86,132 140.25,132 | LED49.1-VDD 14.95,160.78 18.97,156.76 39.92,156.76 | 39.92,156.76 64.69,156.76 | 64.69,156.76 90.09,156.76 | 90.09,156.76 v96.44,156.76 | v104.06,156.76 114.86,156.76 | 114.86,156.76 140.25,156.76 | 140.25,156.76 164.38,156.76 | 164.38,156.76 185.87,156.76 LED56.1-VDD | LED57.1-VDD 15.92,185.85 18.34,183.44 39.92,183.44 | 39.92,183.44 65.33,183.44 | 65.33,183.44 90.72,183.44 | 90.72,183.44 v96.44,183.44 | v104.06,183.44 114.86,183.44 | 114.86,183.44 139.62,183.44 | 139.62,183.44 165.02,183.44 | 165.02,183.44 187.53,183.44 LED64.1-VDD | LED58.1-VDD 39.95,184.09 39.92,183.44 | LED59.1-VDD 64.95,183.81 65.33,183.44 | LED60.1-VDD 89.95,183.57 90.72,183.44
  Top 1.27: LED61.1-VDD 114.95,183.53 114.86,183.44 | LED62.1-VDD 139.95,183.76 139.62,183.44 | LED50.1-VDD 39.95,156.79 39.92,156.76 | LED51.1-VDD 64.95,157.03 64.69,156.76 | LED53.1-VDD 114.95,156.86 114.86,156.76 | LED52.1-VDD 89.95,156.91 90.09,156.76 | LED55.1-VDD 164.95,157.33 164.38,156.76 | LED54.1-VDD 139.95,157.07 140.25,156.76 | LED42.1-VDD 39.95,132.03 39.92,132 | LED43.1-VDD 64.95,132.26 64.69,132 | LED44.1-VDD 89.95,132.14 90.09,132 | LED45.1-VDD 114.95,132.09 114.86,132 | LED46.1-VDD 139.95,132.31 140.25,132 | LED33.1-VDD 14.95,110.62 17.7,108.5 39.92,108.5 | 39.92,108.5 64.69,108.5 | 64.69,108.5 90.09,108.5 | 90.09,108.5 v96.44,108.5 | v104.06,108.5 114.86,108.5 | 114.86,108.5 115.49,108.5 140.25,108.5 | 140.25,108.5 161.97,108.5 LED39.1-VDD | LED40.1-VDD 191.5,110.85 192.32,111.68 192.32,133.47 LED48.1-VDD 186.1,132 165.02,132 | LED34.1-VDD 39.95,109.17 39.92,108.5 | LED35.1-VDD 64.95,108.77 64.69,108.5 | LED36.1-VDD 89.95,109.28 90.09,108.5 | LED26.1-VDD 39.95,82.5 39.92,82.47 | LED27.1-VDD 64.95,82.73 64.69,82.47 | LED28.1-VDD 89.95,82.61 90.09,82.47 | LED29.1-VDD 114.95,82.56 114.86,82.47 | LED30.1-VDD 139.95,82.78 140.25,82.47 | LED31.1-VDD 164.95,82.54 165.02,82.47 | LED20.1-VDD 89.95,58.48 90.09,58.34 | LED19.1-VDD 64.95,58.6 64.69,58.34 | LED18.1-VDD 39.95,58.37 39.29,58.34 | LED10.1-VDD 39.95,32.97 39.92,32.94 | LED11.1-VDD 64.95,33.2 64.69,32.94 | LED12.1-VDD 89.95,33.44 89.45,32.94 | LED13.1-VDD 114.95,33.03 114.86,32.94 | LED14.1-VDD 139.95,33.27 139.62,32.94 | LED15.1-VDD 164.95,33.5 164.38,32.94 | LED7.1-VDD 164.95,8.25 165.02,8.18 | LED6.1-VDD 139.95,8.48 140.25,8.18 | LED5.1-VDD 114.95,8.27 114.86,8.18
  Top 1.27: LED4.1-VDD 89.95,8.31 90.09,8.18 | LED3.1-VDD 64.95,8.44 64.69,8.18 | LED2.1-VDD 39.95,8.2 39.92,8.18 | 140.25,132 165.02,132 | LED47.1-VDD 164.95,132.07 165.02,132 | LED63.1-VDD 164.95,183.5 165.02,183.44 | v104.06,58.34 114.86,58.34 | 114.86,58.34 140.25,58.34 | 140.25,58.34 165.02,58.34 | 165.02,58.34 187.44,58.34 LED24.1-VDD | LED23.1-VDD 164.95,58.41 165.02,58.34 | LED22.1-VDD 139.95,58.65 140.25,58.34 | LED21.1-VDD 114.95,58.44 114.86,58.34 | LED37.1-VDD 114.95,108.6 114.86,108.5 | LED38.1-VDD 139.95,108.81 140.25,108.5
  Top 1.676: D1.C v100.25,49.45 v100.25,50.72 | v100.25,46.91 v100.25,45.64
  Top 1.778: v96.44,8.18 v97.71,8.18 v98.98,8.18 v100.25,8.18 v101.52,8.18 v102.79,8.18 v104.06,8.18
  Top 2.54: v96.44,32.94 v97.71,32.94 v98.98,32.94 v100.25,32.94 v101.52,32.94 v102.79,32.94 v104.06,32.94 | v96.44,58.34 v97.71,58.34 v98.98,58.34 v100.25,58.34 v101.52,58.34 v102.79,58.34 v104.06,58.34 | v96.44,82.47 v97.71,82.47 v98.98,82.47 v100.25,82.47 v101.52,82.47 v102.79,82.47 v104.06,82.47 | v96.44,132 v97.71,132 v98.98,132 v100.25,132 v101.52,132 v102.79,132 v104.06,132 | v96.44,156.76 v97.71,156.76 v98.98,156.76 v100.25,156.76 v101.52,156.76 v102.79,156.76 v104.06,156.76 | v96.44,183.44 v97.71,183.44 v98.98,183.44 v100.25,183.44 v101.52,183.44 v102.79,183.44 v104.06,183.44 | v96.44,108.5 v97.71,108.5 v98.98,108.5 v100.25,108.5 v101.52,108.5 v102.79,108.5 v104.06,108.5 | v100.25,49.45 v100.25,48.18 v100.25,46.91
  Bottom 1.778: J6.2 100.25,151.69
  Bottom 2.54: v96.44,8.18 v97.71,8.18 v98.98,8.18 v100.25,8.18 | v100.25,8.18 v101.52,8.18 v102.79,8.18 v104.06,8.18 | v100.25,8.18 v100.25,32.94 | v100.25,58.34 v100.25,82.47 | v100.25,82.47 v100.25,108.5 | v100.25,108.5 v100.25,132 | v100.25,132 100.25,151.69 v100.25,156.76 | v100.25,156.76 100.25,170.1 | 100.25,170.1 v100.25,183.44 | v100.25,183.44 v101.52,183.44 v102.79,183.44 v104.06,183.44 | v100.25,183.44 v98.98,183.44 v97.71,183.44 v96.44,183.44 | v96.44,32.94 v97.71,32.94 v98.98,32.94 v100.25,32.94 | v100.25,32.94 v101.52,32.94 v102.79,32.94 v104.06,32.94 | v96.44,58.34 v97.71,58.34 v98.98,58.34 v100.25,58.34 | v100.25,58.34 v101.52,58.34 v102.79,58.34 v104.06,58.34 | v96.44,82.47 v97.71,82.47 v98.98,82.47 v100.25,82.47 | v100.25,82.47 v101.52,82.47 v102.79,82.47 v104.06,82.47 | v96.44,108.5 v97.71,108.5 v98.98,108.5 v100.25,108.5 | v100.25,108.5 v101.52,108.5 v102.79,108.5 v104.06,108.5 | v96.44,132 v97.71,132 v98.98,132 v100.25,132 | v100.25,132 v101.52,132 v102.79,132 v104.06,132 | v96.44,156.76 v97.71,156.76 v98.98,156.76 v100.25,156.76 | v100.25,156.76 v101.52,156.76 v102.79,156.76 v104.06,156.76 | v100.25,32.94 v100.25,45.64 | v100.25,46.91 v100.25,48.18 v100.25,49.45 v100.25,50.72 v100.25,58.34 | 99.49,167.69 100.25,170.1
12V
  Top 2.54: U$1.IN@2 U$1.IN@1 110.16,170.74 F3.1
ADC  (via drill 0.6)
  Top 0.406: TP4.TP v186.61,92
  Bottom 0.406: v186.61,92 v186.61,92.01 X1.2
CH_PD
  Bottom 0.406: X1.3 184.59,80.05 185.34,79.3 J13.3
D0
  Bottom 0.406: X1.12 180.59,123.42 J10.2
D12  (via drill 0.6)
  Top 0.406: TP5.TP v178.67,92
  Bottom 0.406: v178.67,92 178.67,91.95 X1.6
GND  (via drill 0.6)
  other vias: 8.18,14.21 10.08,65.96 34.84,65.96 57.7,64.06 82.79,64.06 107.87,64.06 132.63,64.06 157.72,64.06 182.8,64.06 192.96,87.23 158.03,89.14 132.95,89.14 107.87,89.14 83.11,89.14 57.7,89.14 32.62,89.14 10.08,91.04 8.18,114.22 32.94,114.22 58.02,114.22 82.79,114.22 107.87,114.22 132.95,114.22 157.72,114.22 182.8,114.22 183.12,138.99 158.03,139.3 132.95,139.3 107.87,139.3 83.11,139.3 58.02,139.3 32.94,139.3 8.18,139.3 7.86,164.38 33.26,164.07 58.02,164.07 83.11,164.07 107.87,164.07 133.27,164.07 158.35,164.07 183.12,164.07 183.12,189.15 158.03,189.15 132.95,189.15 107.87,189.15 83.11,189.15 58.02,189.15 32.94,189.15 8.18,189.15 10.08,41.2 32.94,39.29 58.02,39.29 83.11,39.29 107.87,39.29 132.95,39.29 158.03,39.29 183.12,38.97 183.12,14.21 158.03,14.21 132.95,14.21 108.19,14.21 83.11,14.21 58.02,14.21 32.94,14.21 96.44,44.37 105.97,44.37 176.45,48.18 171.37,89.77 171.69,107.23 171.69,108.5 172.96,108.5
  pour Bottom (isolate 0.406, rank 5): 3,3 3,196.5 196,196.5 196,100.2 195.9,100.2 195.9,3
  pour Top (isolate 0.406, rank 5): 5,3.9 3.6,3.9 3.6,195.6 195.3,195.6 195.3,92.4 195.5,92.4 195.5,4.3
LEDS_DATA  (via drill 0.6)
  Top 0.406: TP6.TP 90.14,94.91 R1.2 179.89,94.91 180.58,94.22 v180.58,92
  Bottom 0.406: v180.58,92 180.58,92.02 X1.5
LEDS_DIN  (via drill 0.6)
  Top 0.61: J7.1 47.55,44.37 48.81,45.64 v48.81,50.72 | v48.81,98.34 95.17,98.34 | 95.17,98.34 96.28,98.34 LED65.4-DIN | R1.1 94.85,98.03 95.17,98.34
  Bottom 0.61: v48.81,50.72 v48.81,98.34
LEDS_DOUT  (via drill 0.6)
  Top 0.406: v156.76,191.69 189.15,191.69 189.78,191.06 189.78,189.31 LED64.2-DOUT
  Bottom 0.406: v156.76,191.69 J8.1
N$1
  Top 0.406: LED1.2-DOUT 28.23,14.15 31.67,10.71 34.91,10.71 LED2.4-DIN
N$2
  Top 0.406: LED2.2-DOUT 53.63,14.15 57.07,10.71 59.91,10.71 LED3.4-DIN
N$3
  Top 0.406: LED3.2-DOUT 78.4,14.15 81.83,10.71 84.92,10.71 LED4.4-DIN
N$4
  Top 0.406: LED4.2-DOUT 103.17,14.15 106.6,10.71 109.92,10.71 LED5.4-DIN
N$5
  Top 0.406: LED5.2-DOUT 127.93,14.15 131.37,10.71 134.91,10.71 LED6.4-DIN
N$6
  Top 0.406: LED6.2-DOUT 152.69,14.15 156.13,10.71 159.91,10.71 LED7.4-DIN
N$7
  Top 0.406: LED7.2-DOUT 178.73,14.15 182.16,10.71 184.91,10.71 LED8.4-DIN
N$8
  Top 0.406: LED8.2-DOUT 189.95,16.27 189.15,17.06 17.06,17.06 10.08,24.05 10.08,35.82 LED9.4-DIN
N$9
  Top 0.406: LED1.4-DIN 9.91,10.71 8.81,10.71 6.91,12.62 6.91,111.68 7.54,112.31 11.98,112.31 12.62,111.68 12.62,105.97 13.89,104.69 101.84,104.69 102.47,104.06 102.47,101.67 LED65.2-DOUT
N$10
  Bottom 0.406: X1.11 178.59,110.38 R3.1
N$11
  Bottom 0.406: R4.1 175.81,109.14 176.45,108.5 176.45,107.17 X1.10
N$12  (via drill 0.6)
  Top 0.406: R2.1 182.48,99.3 183.44,98.98 188.2,98.98 188.83,98.34 188.83,92.31 v188.51,92
  Bottom 0.406: v188.51,92 188.51,91.95 X1.1
N$13  (via drill 0.6)
  Top 0.406: v182.8,92 182.8,97.13 R2.2
  Bottom 0.406: X1.4 182.59,91.57 v182.8,92
N$14
  Bottom 0.813: J6.1 TP3.TP
  Bottom 1.778: U$1.OUT@1 114.73,149.02 J6.1
  Bottom 2.54: U$1.OUT@2 U$1.OUT@1
N$15  (via drill 0.6)
  other vias: 10.71,172.64
N$16
  Top 0.406: LED9.2-DOUT 29.27,39.15 32.94,35.48 34.68,35.48 LED10.4-DIN
N$17
  Top 0.406: LED10.2-DOUT 54.03,39.15 57.7,35.48 59.68,35.48 LED11.4-DIN
N$18
  Top 0.406: LED11.2-DOUT 79.44,39.15 82.47,36.11 84.78,36.11 LED12.4-DIN
N$19
  Top 0.61: LED12.2-DOUT 103.56,39.15 106.6,36.11 109.78,36.11 LED13.4-DIN
N$20
  Top 0.406: LED13.2-DOUT 128.97,39.15 132,36.11 134.78,36.11 LED14.4-DIN
N$21
  Top 0.406: LED14.2-DOUT 154.37,39.15 158.03,35.48 159.68,35.48 LED15.4-DIN
N$22
  Top 0.406: LED15.2-DOUT 178.5,39.15 182.16,35.48 184.68,35.48 LED16.4-DIN
N$23  (via drill 0.6)
  Top 0.406: LED16.2-DOUT 192.19,39.15 192.96,39.92 192.96,69.14 191.69,70.41 v21.51,70.41 | v21.51,62.47 11.67,62.47 LED17.4-DIN
  Bottom 0.406: v21.51,70.41 v21.51,62.47
N$24
  Top 0.406: LED17.2-DOUT 31.75,64.15 LED18.4-DIN
N$25
  Top 0.406: LED18.2-DOUT 54.44,64.15 57.7,60.88 60.02,60.88 LED19.4-DIN
N$26
  Top 0.406: LED19.2-DOUT 77.93,64.15 81.2,60.88 85.02,60.88 LED20.4-DIN
N$27
  Top 0.406: LED20.2-DOUT 103.33,64.15 107.23,60.24 109.44,60.24 LED21.4-DIN
N$28
  Top 0.406: LED21.2-DOUT 128.73,64.15 132,60.88 135.02,60.88 LED22.4-DIN
N$29
  Top 0.406: LED22.2-DOUT 154.13,64.15 157.4,60.88 160.02,60.88 LED23.4-DIN
N$30
  Top 0.406: LED23.2-DOUT 179.53,64.15 182.8,60.88 185.02,60.88 LED24.4-DIN
N$31
  Top 0.406: LED24.2-DOUT 189.95,67.06 188.51,68.5 15.16,68.5 10.08,73.58 10.08,85.01 9.45,85.64 9.84,85.64 LED25.4-DIN
N$32
  Top 0.406: LED25.2-DOUT 28.16,89.15 31.67,85.64 34.84,85.64 LED26.4-DIN
N$33
  Top 0.406: LED26.2-DOUT 54.2,89.15 57.07,86.28 59.62,86.28 LED27.4-DIN
N$34
  Top 0.406: LED27.2-DOUT 78.97,89.15 82.47,85.64 84.84,85.64 LED28.4-DIN
N$35
  Top 0.406: LED28.2-DOUT 104.36,89.15 107.87,85.64 109.84,85.64 LED29.4-DIN
N$36
  Top 0.406: LED29.2-DOUT 128.5,89.15 132,85.64 134.84,85.64 LED30.4-DIN
N$37
  Top 0.406: LED30.2-DOUT 152.62,89.15 156.13,85.64 159.84,85.64 LED31.4-DIN
N$38
  Top 0.406: LED31.2-DOUT 167.87,89.15 171.37,85.64 184.84,85.64 LED32.4-DIN
N$39
  Top 0.406: LED33.4-DIN 10.08,110.82 10.08,98.34 15.79,92.63 124.38,92.63 126.28,90.72 168.19,90.72 171.37,87.55 187.88,87.55 189.48,89.15 LED32.2-DOUT
N$40
  Top 0.406: LED33.2-DOUT 29.84,114.15 32.94,111.05 34.86,111.05 LED34.4-DIN
N$41
  Top 0.406: LED34.2-DOUT 53.33,114.15 56.44,111.05 59.85,111.05 LED35.4-DIN
N$42
  Top 0.406: LED35.2-DOUT 78.73,114.15 81.83,111.05 84.86,111.05 LED36.4-DIN
N$43
  Top 0.406: LED36.2-DOUT 102.86,114.15 105.97,111.05 109.86,111.05 LED37.4-DIN
N$44
  Top 0.406: LED37.2-DOUT 126.99,114.15 130.09,111.05 134.85,111.05 LED38.4-DIN
N$45
  Top 0.406: LED38.2-DOUT 154.29,114.15 157.4,111.05 159.85,111.05 LED39.4-DIN
N$46
  Top 0.406: LED39.2-DOUT 179.06,114.15 182.16,111.05 184.85,111.05 LED40.4-DIN
N$47
  Top 0.406: LED40.2-DOUT 189.95,116.59 187.88,118.67 13.26,118.67 10.08,121.84 10.08,135.82 LED41.4-DIN
N$48
  Top 0.406: LED41.2-DOUT 29.6,139.15 32.94,135.81 35.01,135.81 LED42.4-DIN
N$49
  Top 0.406: LED42.2-DOUT 54.37,139.15 57.7,135.81 60.01,135.81 LED43.4-DIN
N$50
  Top 0.406: LED43.2-DOUT 79.77,139.15 83.11,135.81 85.01,135.81 LED44.4-DIN
N$51
  Top 0.406: LED44.2-DOUT 103.89,139.15 107.23,135.81 110.01,135.81 LED45.4-DIN
N$52
  Top 0.406: LED45.2-DOUT 128.66,139.15 132,135.81 134.54,135.81 135.01,135.81 | 135.81,135.81 135.01,135.81 | 135.01,135.81 LED46.4-DIN
N$53
  Top 0.406: LED46.2-DOUT 152.16,139.15 155.5,135.81 160.01,135.81 LED47.4-DIN
N$54
  Top 0.406: LED47.2-DOUT 178.82,139.15 182.16,135.81 185.01,135.81 LED48.4-DIN
N$55
  Top 0.406: LED48.2-DOUT 189.95,142 189.15,142.79 78.03,142.79 76.12,144.7 76.12,152.32 74.85,153.59 18.34,153.59 15.79,156.13 11.35,156.13 10.08,157.4 10.08,160.82 LED49.4-DIN
N$56
  Top 0.406: LED49.2-DOUT 28.09,164.15 31.04,161.21 34.69,161.21 LED50.4-DIN
N$57
  Top 0.406: LED50.2-DOUT 52.86,164.15 56.44,160.57 59.77,160.57 LED51.4-DIN
N$58
  Top 0.406: LED51.2-DOUT 76.36,164.15 79.93,160.57 84.78,160.57 LED52.4-DIN
N$59
  Top 0.406: LED52.2-DOUT 100.48,164.15 104.06,160.57 109.78,160.57 LED53.4-DIN
N$60
  Top 0.406: LED53.2-DOUT 128.43,164.15 131.37,161.21 133.91,161.21 134.54,160.57 135.18,160.57 135.05,160.7 LED54.4-DIN
N$61
  Top 0.406: LED54.2-DOUT 151.92,164.15 155.5,160.57 159.78,160.57 LED55.4-DIN
N$62
  Top 0.406: LED55.2-DOUT 178.59,164.15 182.16,160.57 184.78,160.57 LED56.4-DIN
N$63
  Top 0.305: 10.08,185.82 10.08,182.16 11.35,180.9 192.32,180.9 193.59,179.62 193.59,164.7 192.96,164.07 190.03,164.07 LED56.2-DOUT
  Top 0.406: 10.08,185.82 LED57.4-DIN
N$64
  Top 0.406: LED57.2-DOUT 27.23,189.15 30.4,185.97 34.92,185.97 LED58.4-DIN
N$65
  Top 0.406: LED58.2-DOUT 53.26,189.15 56.44,185.97 59.92,185.97 LED59.4-DIN
N$66
  Top 0.406: LED59.2-DOUT 78.03,189.15 81.2,185.97 85.01,185.97 | 85.01,185.97 85.64,185.97 | LED60.4-DIN 85.05,185.94 85.01,185.97
N$67
  Top 0.406: LED60.2-DOUT 102.79,189.15 105.97,185.97 109.92,185.97 LED61.4-DIN
N$68
  Top 0.406: LED61.2-DOUT 125.65,189.15 128.82,185.97 134.93,185.97 LED62.4-DIN
N$69
  Top 0.406: LED62.2-DOUT 151.69,189.15 154.86,185.97 159.93,185.97 LED63.4-DIN
N$70
  Top 0.406: LED63.2-DOUT 177.09,189.15 180.26,185.97 184.93,185.97 LED64.4-DIN
N$71  (via drill 0.6)
  other vias: 11.98,172.64
N$72  (via drill 0.6)
  other vias: 13.26,172.64
N$73  (via drill 0.6)
  other vias: 14.53,172.64
N$74  (via drill 0.6)
  other vias: 15.79,172.64
N$80
  Top 2.54: J11.2 188.44,177.64 178.35,168.19 171.37,168.19 161.84,177.72 128.82,177.72 | 128.82,177.72 37.38,177.72 27.86,168.19 21.51,168.19 16.75,172.32 8.57,172.32 J9.2 | F3.2 128.72,177.61 128.82,177.72
  Bottom 2.54: J9.2 16.35,172.72 17.06,172 17.06,150.51 J12.PWR
N$105  (via drill 0.6)
  other vias: 86.92,138.99
N$120  (via drill 0.6)
  other vias: 92,86.28
N$133
  Top 1.676: F1.1 D1.A
N$134
  Top 0.61: LED65.1-VDD D2.C
N$136
  Top 0.406: J8.2 J2.1
N$137
  Top 2.184: J1.9 J4.1
  Top 2.54: J1.7 J1.9
N$141
  Top 0.813: J7.2 J1.1
RX  (via drill 0.6)
  Top 0.406: v96.44,41.83 v105.97,41.83
  Bottom 0.406: 170.1,50.09 165.66,50.09 164.38,51.35 164.38,102.16 165.66,103.42 185.97,103.42 186.59,104.04 X1.15 186.59,116.14 185.97,116.76 183.44,116.76 183.12,117.08 J10.3 | 170.1,50.09 J2.5 | J1.3 68.5,46.91 73.58,41.83 v96.44,41.83 | v105.97,41.83 167.56,41.83 170.1,44.37 170.1,50.09
SCL  (via drill 0.6)
  Top 0.406: J14.4 181.85,104.69 182.48,105.33 v182.48,106.92
  Bottom 0.406: v182.48,106.92 182.48,107.14 X1.13
SDA  (via drill 0.6)
  Top 0.406: J14.3 183.44,102.16 184.71,103.42 v184.71,106.92
  Bottom 0.406: v184.71,106.92 184.71,107.14 X1.14
TX  (via drill 0.6)
  Top 0.406: v95.17,43.1 v104.06,43.1 | v168.19,48.81 v168.19,52.62
  Bottom 0.406: J2.3 v168.19,52.62 166.93,52.62 165.66,53.9 165.66,101.52 166.29,102.16 187.88,102.16 188.59,102.86 X1.16 188.59,117.32 187.88,118.03 185.97,118.03 185.66,118.35 J10.4 | J1.5 12.62,49.45 13.89,48.18 69.14,48.18 74.22,43.1 v95.17,43.1 | v104.06,43.1 166.29,43.1 168.19,45.01 v168.19,48.81
VIN
  Top 1.676: 79.41,54.42 19.61,54.53
  Top 2.184: J4.2 19.61,54.53
  Top 2.54: 19.61,54.53 127.56,54.53 136.44,45.64 187.88,45.64 188.51,46.27 J2.7 J2.9 | F1.2 79.41,54.42